# EAGLE design cnc_1_0_0 (EAGLE 6.2)

## Sheet 1 of 6
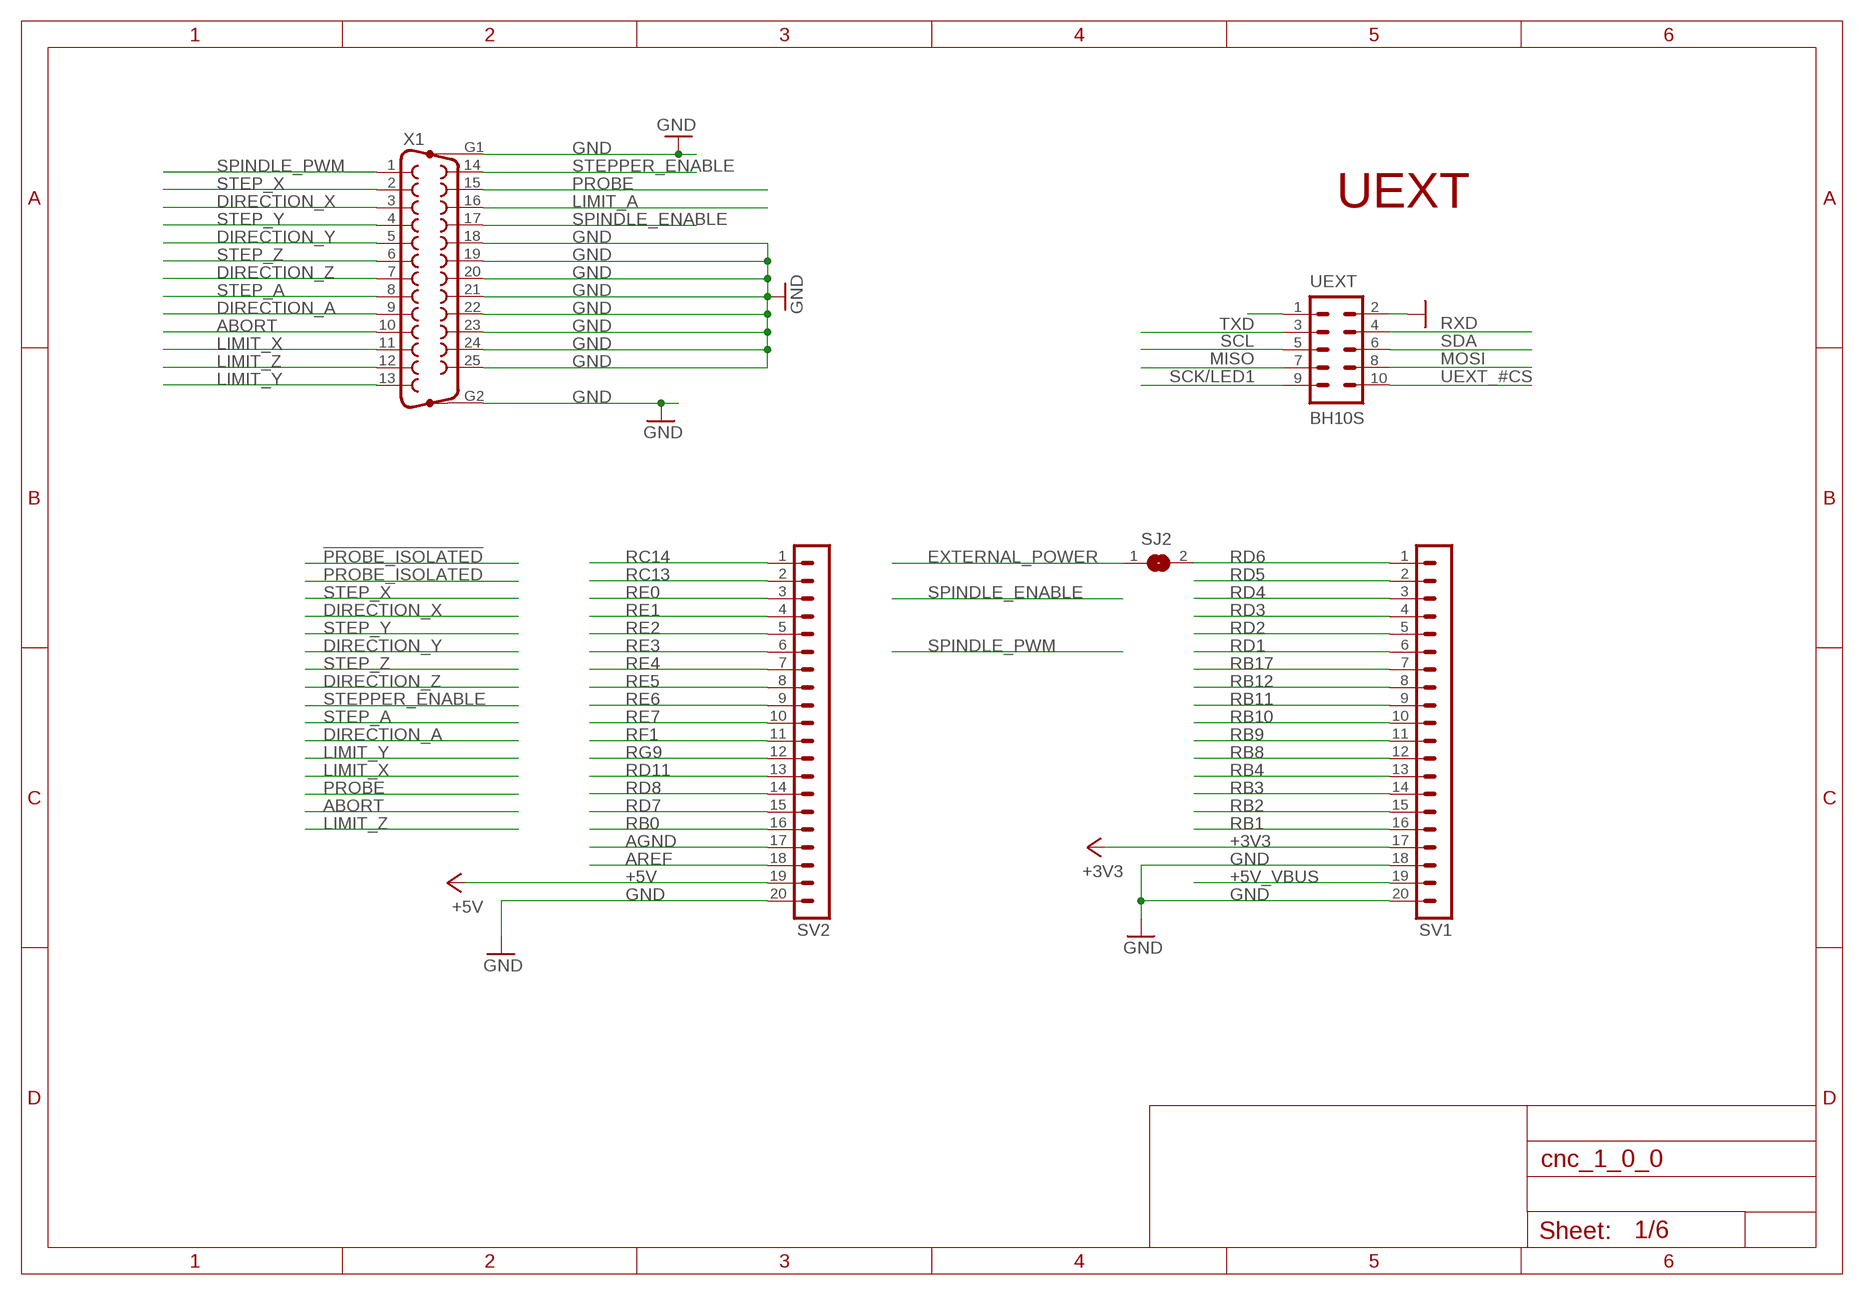
[diagram p0: schematic, sheet 1]

### Parts
SJ2  SJ  [SJ]
SV1  MA20-1  [MA20-1]
SV2  MA20-1  [MA20-1]
UEXT  BH10S  ML10  [ML10-MALE]
X1  F25HP  [F25HP]

### Nets
+3V3: SV1.17 ; also sheet 3,4,5
+5V [pwr]: SV2.19 ; also sheet 2,3,4
+5V_VBUS: SV1.19
ABORT: X1.10 ; also sheet 4
AGND: SV2.17
AREF: SV2.18
DIRECTION_A: X1.9 ; also sheet 3
DIRECTION_X: X1.3 ; also sheet 3
DIRECTION_Y: X1.5 ; also sheet 3
DIRECTION_Z: X1.7 ; also sheet 3
EXTERNAL_POWER: SJ2.1 ; also sheet 4
GND: SV1.18 SV1.20 SV2.20 UEXT.2 X1.18 X1.19 X1.20 X1.21 X1.22 X1.23 X1.24 X1.25 X1.G1 X1.G2 ; also sheet 2,3,4,5
LIMIT_A: X1.16
LIMIT_X: X1.11 ; also sheet 4
LIMIT_Y: X1.13 ; also sheet 4
LIMIT_Z: X1.12 ; also sheet 4
MISO: UEXT.7 ; also sheet 5
MOSI: UEXT.8 ; also sheet 5
N$9: UEXT.1
PROBE: X1.15 ; also sheet 4
RB0: SV2.16 ; also sheet 4
RB1: SV1.16
RB2: SV1.15
RB3: SV1.14
RB4: SV1.13
RB8: SV1.12
RB9: SV1.11
RB10: SV1.10
RB11: SV1.9
RB12: SV1.8
RB17: SV1.7
RC13: SV2.2 ; also sheet 4
RC14: SV2.1 ; also sheet 4
RD1: SV1.6 ; also sheet 3
RD2: SV1.5
RD3: SV1.4
RD4 [signal]: SV1.3 ; also sheet 3
RD5: SV1.2
RD6: SJ2.2 SV1.1
RD7: SV2.15 ; also sheet 4
RD8: SV2.14 ; also sheet 4
RD11: SV2.13 ; also sheet 4
RE0: SV2.3 ; also sheet 3
RE1: SV2.4 ; also sheet 3
RE2: SV2.5 ; also sheet 3
RE3: SV2.6 ; also sheet 3
RE4: SV2.7 ; also sheet 3
RE5: SV2.8 ; also sheet 3
RE6: SV2.9 ; also sheet 3
RE7: SV2.10 ; also sheet 3
RF1: SV2.11 ; also sheet 3
RG9: SV2.12 ; also sheet 4
RXD: UEXT.4
SCK/LED1: UEXT.9 ; also sheet 5
SCL: UEXT.5
SDA: UEXT.6
SPINDLE_ENABLE: X1.17 ; also sheet 3
SPINDLE_PWM: X1.1 ; also sheet 3
STEP_A: X1.8 ; also sheet 3
STEP_X: X1.2 ; also sheet 3
STEP_Y: X1.4 ; also sheet 3
STEP_Z: X1.6 ; also sheet 3
STEPPER_ENABLE: X1.14 ; also sheet 3
TXD: UEXT.3
UEXT_#CS: UEXT.10 ; also sheet 5

### Notes on the sheet
- UEXT

## Sheet 2 of 6
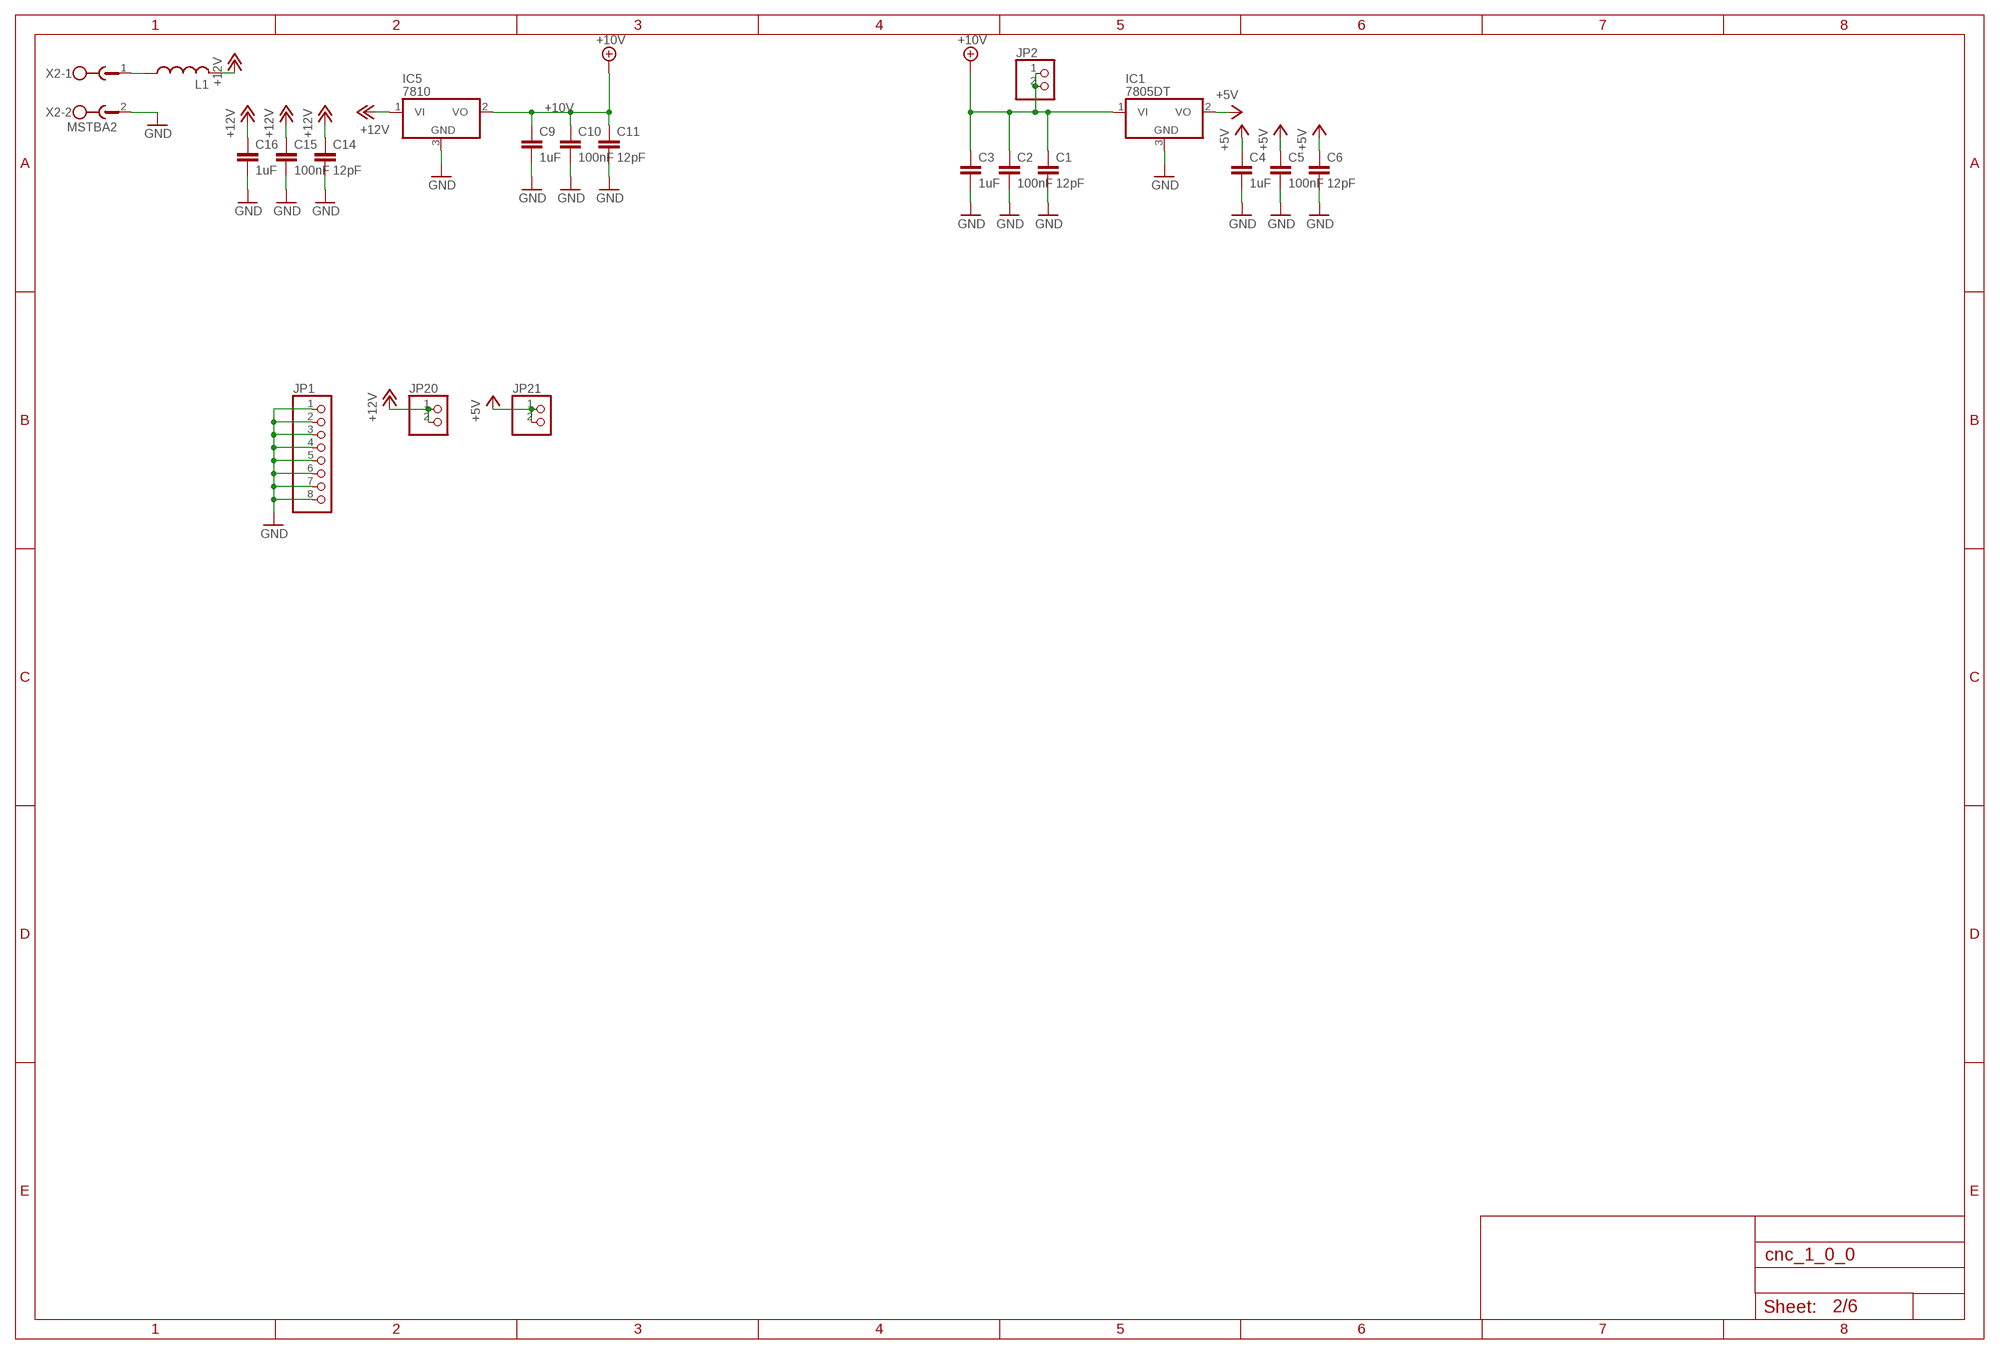
[diagram p1: schematic, sheet 2]

### Parts
C1  12pF  C-EUC0805K  [C0805K]
C2  100nF  C-EUC0805K  [C0805K]
C3  1uF  C-EUC0805K  [C0805K]
C4  1uF  C-EUC0805K  [C0805K]
C5  100nF  C-EUC0805K  [C0805K]
C6  12pF  C-EUC0805K  [C0805K]
C9  1uF  C-EUC0805K  [C0805K]
C10  100nF  C-EUC0805K  [C0805K]
C11  12pF  C-EUC0805K  [C0805K]
C14  12pF  C-EUC0805K  [C0805K]
C15  100nF  C-EUC0805K  [C0805K]
C16  1uF  C-EUC0805K  [C0805K]
IC1  7805DT  [TO252]
IC5  7810  7805DT  [TO252]
JP1  PINHD-1X8  [1X08]
JP2  PINHD-1X2  [1X02]
JP20  PINHD-1X2  [1X02]
JP21  PINHD-1X2  [1X02]
L1  L-USL1812  [L1812]
X2  MSTBA2  [MSTBA2]

### Nets
+5V [pwr]: C4.1 C5.1 C6.1 IC1.2(VO) JP21.1 JP21.2 ; also sheet 1,3,4
+10V [pwr]: C1.1 C2.1 C3.1 C9.1 C10.1 C11.1 IC1.1(VI) IC5.2(VO) JP2.1 JP2.2 ; also sheet 3
+12V [pwr]: C14.1 C15.1 C16.1 IC5.1(VI) JP20.1 JP20.2 L1.2 ; also sheet 4
GND: C1.2 C2.2 C3.2 C4.2 C5.2 C6.2 C9.2 C10.2 C11.2 C14.2 C15.2 C16.2 IC1.3(GND) IC5.3(GND) JP1.1 JP1.2 JP1.3 JP1.4 JP1.5 JP1.6 JP1.7 JP1.8 X2.2 ; also sheet 1,3,4,5
N$1: L1.1 X2.1

## Sheet 3 of 6
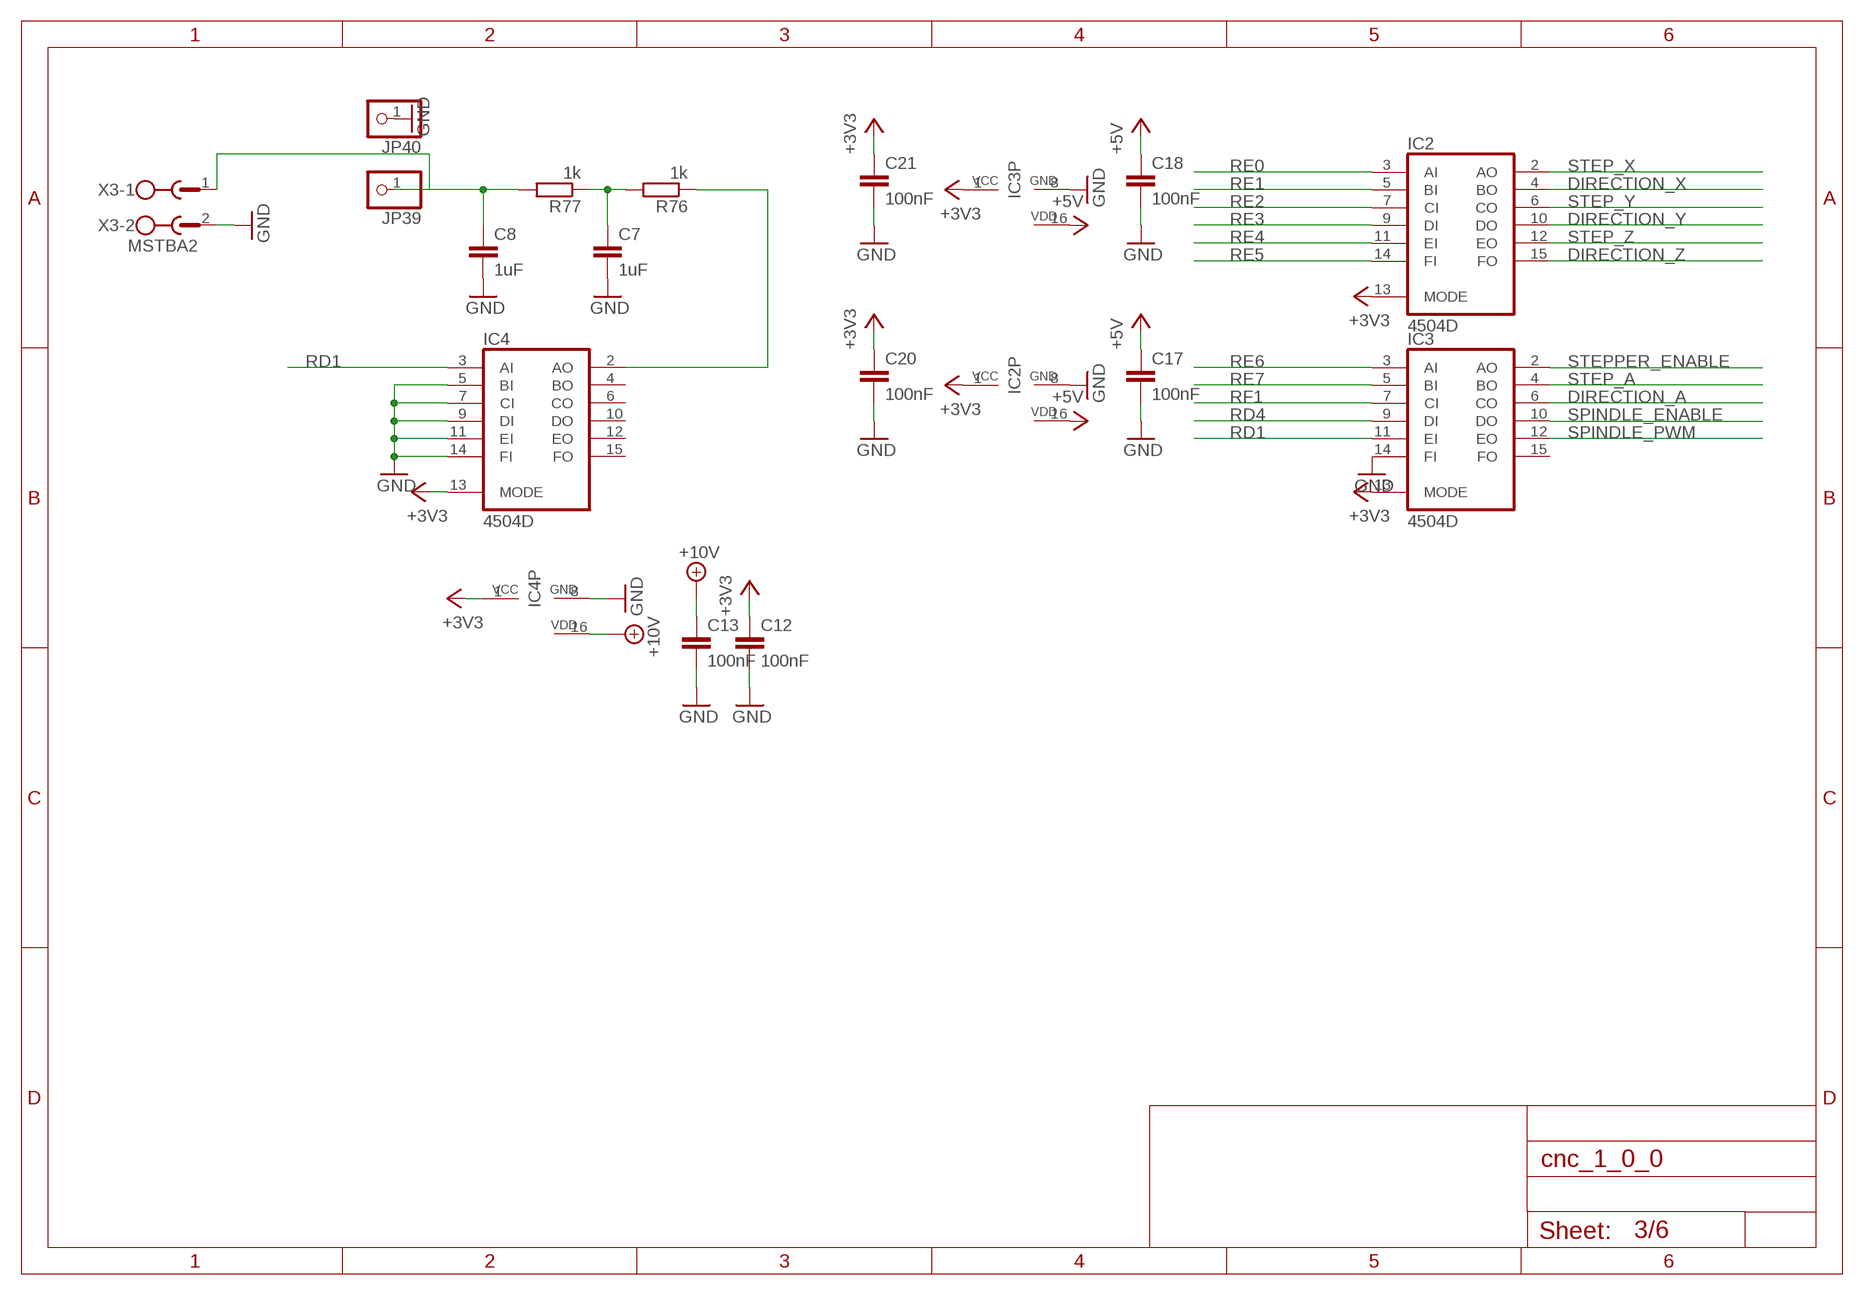
[diagram p2: schematic, sheet 3]

### Parts
C7  1uF  C-EUC0805K  [C0805K]
C8  1uF  C-EUC0805K  [C0805K]
C12  100nF  C-EUC0805K  [C0805K]
C13  100nF  C-EUC0805K  [C0805K]
C17  100nF  C-EUC0805K  [C0805K]
C18  100nF  C-EUC0805K  [C0805K]
C20  100nF  C-EUC0805K  [C0805K]
C21  100nF  C-EUC0805K  [C0805K]
IC2  4504D  [SO16]
IC3  4504D  [SO16]
IC4  4504D  [SO16]
JP39  PINHD-1X1  [1X01]
JP40  PINHD-1X1  [1X01]
R76  1k  R-EU_R0805  [R0805]
R77  1k  R-EU_R0805  [R0805]
X3  MSTBA2  [MSTBA2]

### Nets
+3V3: C12.1 C20.1 C21.1 IC2.1(VCC) IC2.13(MODE) IC3.1(VCC) IC3.13(MODE) IC4.1(VCC) IC4.13(MODE) ; also sheet 1,4,5
+5V [pwr]: C17.1 C18.1 IC2.16(VDD) IC3.16(VDD) ; also sheet 1,2,4
+10V [pwr]: C13.1 IC4.16(VDD) ; also sheet 2
DIRECTION_A: IC3.6(CO) ; also sheet 1
DIRECTION_X: IC2.4(BO) ; also sheet 1
DIRECTION_Y: IC2.10(DO) ; also sheet 1
DIRECTION_Z: IC2.15(FO) ; also sheet 1
GND: C7.2 C8.2 C12.2 C13.2 C17.2 C18.2 C20.2 C21.2 IC2.8(GND) IC3.8(GND) IC3.14(FI) IC4.5(BI) IC4.7(CI) IC4.8(GND) IC4.9(DI) IC4.11(EI) IC4.14(FI) JP40.1 X3.2 ; also sheet 1,2,4,5
N$3: C7.1 R76.2 R77.1
N$45: C8.1 JP39.1 R77.2 X3.1
N$47: IC4.2(AO) R76.1
RD1: IC3.11(EI) IC4.3(AI) ; also sheet 1
RD4 [signal]: IC3.9(DI) ; also sheet 1
RE0: IC2.3(AI) ; also sheet 1
RE1: IC2.5(BI) ; also sheet 1
RE2: IC2.7(CI) ; also sheet 1
RE3: IC2.9(DI) ; also sheet 1
RE4: IC2.11(EI) ; also sheet 1
RE5: IC2.14(FI) ; also sheet 1
RE6: IC3.3(AI) ; also sheet 1
RE7: IC3.5(BI) ; also sheet 1
RF1: IC3.7(CI) ; also sheet 1
SPINDLE_ENABLE: IC3.10(DO) ; also sheet 1
SPINDLE_PWM: IC3.12(EO) ; also sheet 1
STEP_A: IC3.4(BO) ; also sheet 1
STEP_X: IC2.2(AO) ; also sheet 1
STEP_Y: IC2.6(CO) ; also sheet 1
STEP_Z: IC2.12(EO) ; also sheet 1
STEPPER_ENABLE: IC3.2(AO) ; also sheet 1
Unconnected: IC3.15(FO) IC4.4(BO) IC4.6(CO) IC4.10(DO) IC4.12(EO) IC4.15(FO)

## Sheet 4 of 6
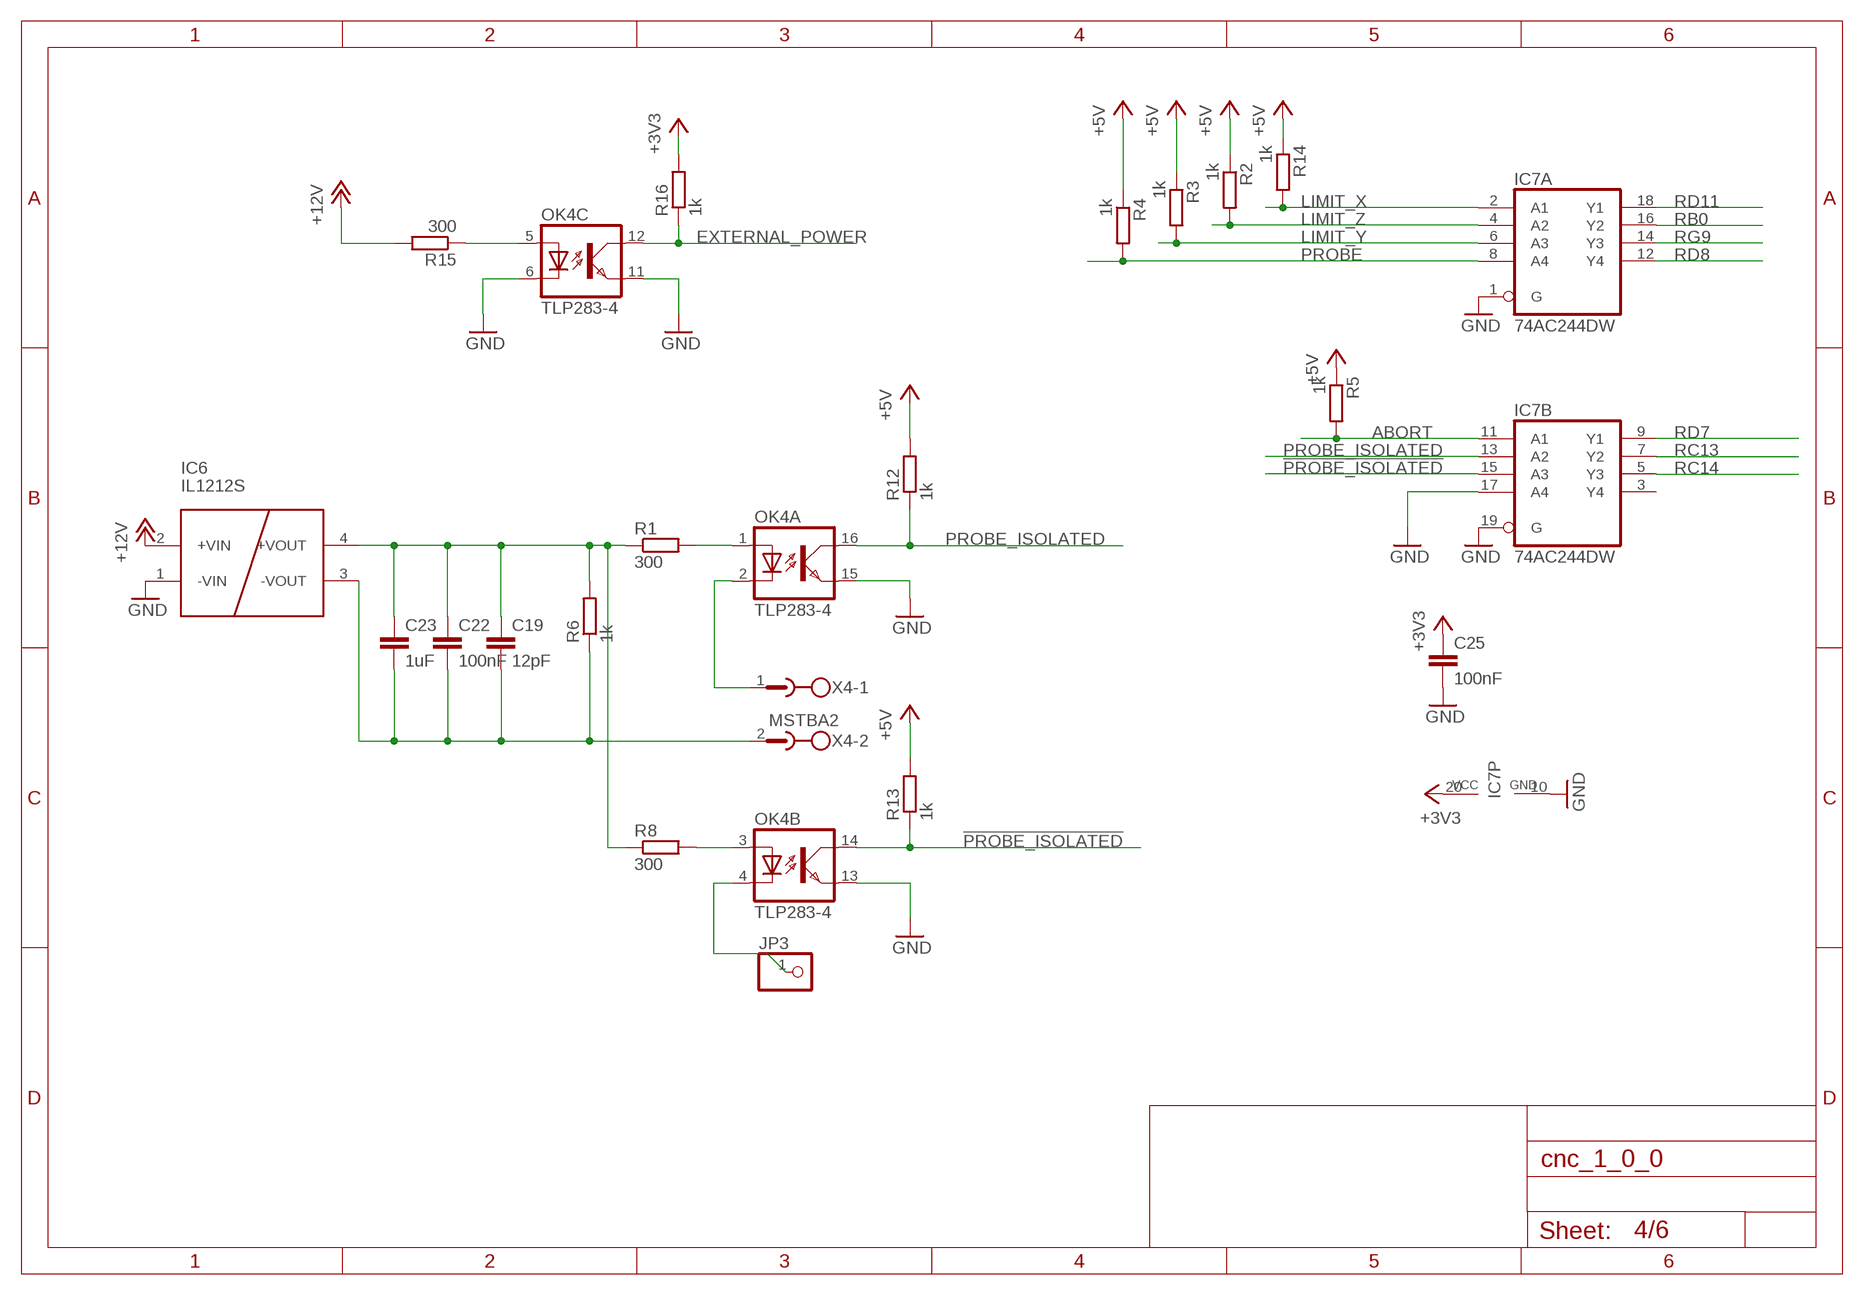
[diagram p3: schematic, sheet 4]

### Parts
C19  12pF  C-EUC0805K  [C0805K]
C22  100nF  C-EUC0805K  [C0805K]
C23  1uF  C-EUC0805K  [C0805K]
C25  100nF  C-EUC0805K  [C0805K]
IC6  IL1212S  IL0512S  [SIL4]
IC7  74AC244DW  [SO20W]
JP3  PINHD-1X1  [1X01]
OK4  TLP283-4  [MINI-FLAT-16]
R1  300  R-EU_R0805  [R0805]
R2  1k  R-EU_R0805  [R0805]
R3  1k  R-EU_R0805  [R0805]
R4  1k  R-EU_R0805  [R0805]
R5  1k  R-EU_R0805  [R0805]
R6  1k  R-EU_R0805  [R0805]
R8  300  R-EU_R0805  [R0805]
R12  1k  R-EU_R0805  [R0805]
R13  1k  R-EU_R0805  [R0805]
R14  1k  R-EU_R0805  [R0805]
R15  300  R-EU_R0805  [R0805]
R16  1k  R-EU_R0805  [R0805]
X4  MSTBA2  [MSTBA2]

### Nets
!PROBE_ISOLATED: IC7.15(B:A3) OK4.14(B:COL) R13.1 ; also sheet 1
+3V3: C25.1 IC7.20(P:VCC) R16.2 ; also sheet 1,3,5
+5V [pwr]: R2.1 R3.1 R4.1 R5.1 R12.2 R13.2 R14.1 ; also sheet 1,2,3
+10V1: C19.1 C22.1 C23.1 IC6.4(+VOUT) R1.1 R6.2 R8.1
+12V [pwr]: IC6.2(+VIN) R15.2 ; also sheet 2
ABORT: IC7.11(B:A1) R5.2 ; also sheet 1
EXTERNAL_POWER: OK4.12(C:COL) R16.1 ; also sheet 1
GND: C25.2 IC6.1(-VIN) IC7.1(A:G) IC7.10(P:GND) IC7.17(B:A4) IC7.19(B:G) OK4.6(C:C) OK4.11(C:EMIT) OK4.13(B:EMIT) OK4.15(A:EMIT) ; also sheet 1,2,3,5
LIMIT_X: IC7.2(A:A1) R14.2 ; also sheet 1
LIMIT_Y: IC7.6(A:A3) R3.2 ; also sheet 1
LIMIT_Z: IC7.4(A:A2) R2.2 ; also sheet 1
N$5: OK4.1(A:A) R1.2
N$6: OK4.2(A:C) X4.1
N$7: C19.2 C22.2 C23.2 IC6.3(-VOUT) R6.1 X4.2
N$11: OK4.3(B:A) R8.2
N$12: JP3.1 OK4.4(B:C)
N$13: OK4.5(C:A) R15.1
PROBE: IC7.8(A:A4) R4.2 ; also sheet 1
PROBE_ISOLATED: IC7.13(B:A2) OK4.16(A:COL) R12.1 ; also sheet 1
RB0: IC7.16(A:Y2) ; also sheet 1
RC13: IC7.7(B:Y2) ; also sheet 1
RC14: IC7.5(B:Y3) ; also sheet 1
RD7: IC7.9(B:Y1) ; also sheet 1
RD8: IC7.12(A:Y4) ; also sheet 1
RD11: IC7.18(A:Y1) ; also sheet 1
RG9: IC7.14(A:Y3) ; also sheet 1
Unconnected: IC7.3(B:Y4) OK4.7(D:A) OK4.8(D:C) OK4.9(D:EMIT) OK4.10(D:COL)

## Sheet 5 of 6
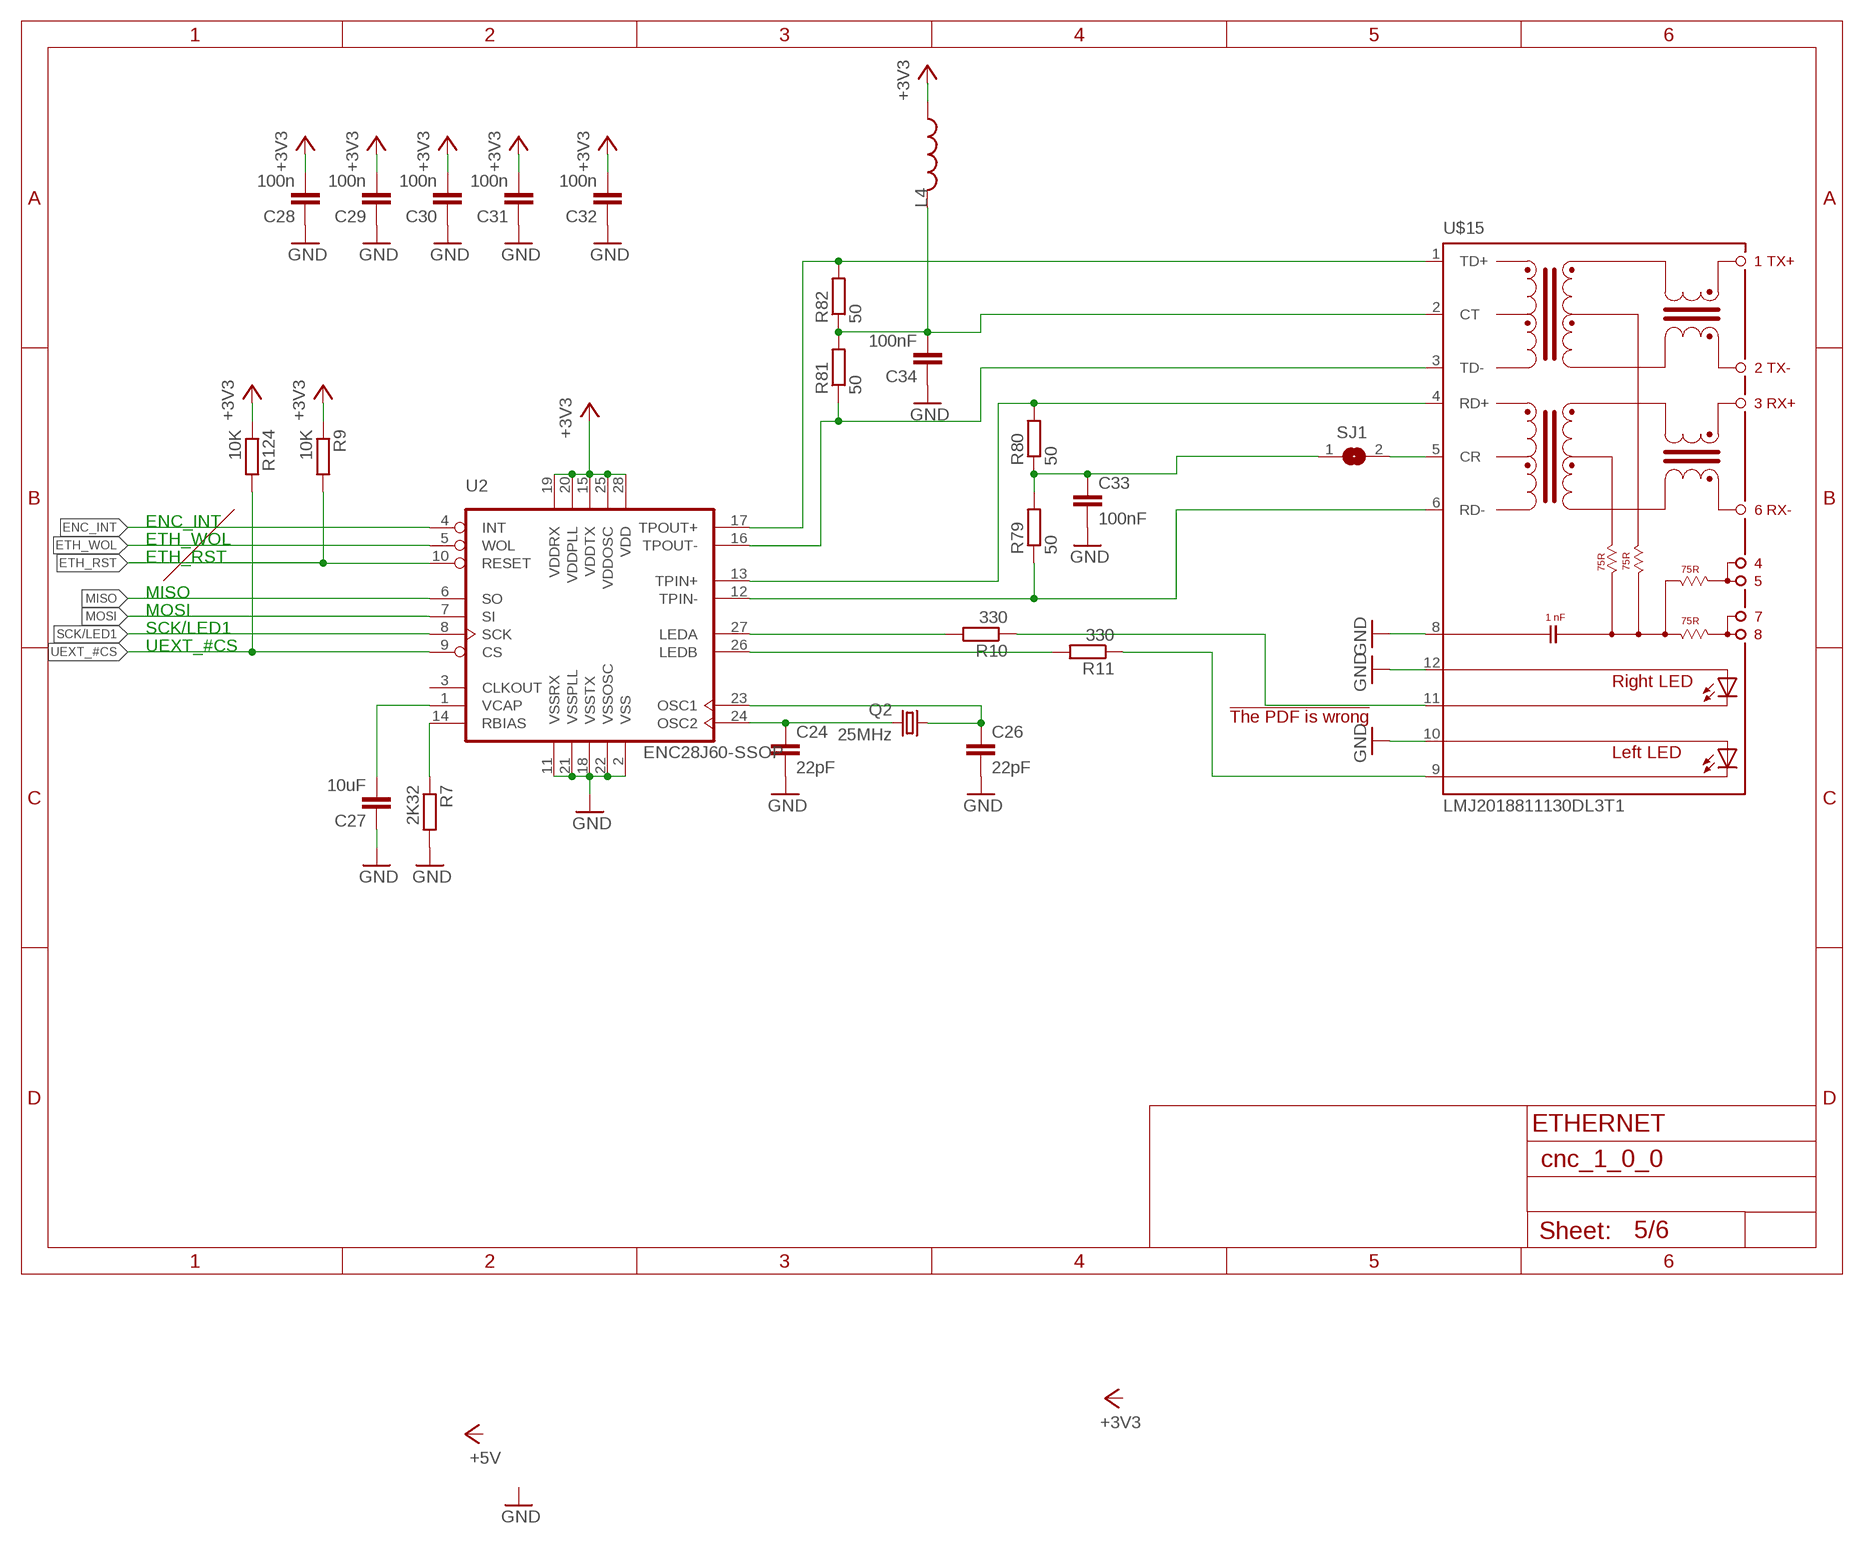
[diagram p4: schematic, sheet 5]

### Parts
C24  22pF  C-EUC0603  [C0603]
C26  22pF  C-EUC0603  [C0603]
C27  10uF  C-EUC0805K  [C0805K]
C28  100n  C-EUC0603  [C0603]
C29  100n  C-EUC0603  [C0603]
C30  100n  C-EUC0603  [C0603]
C31  100n  C-EUC0603  [C0603]
C32  100n  C-EUC0603  [C0603]
C33  100nF  C-EUC0603  [C0603]
C34  100nF  C-EUC0603  [C0603]
L4  INDUCTOR0603  [0603]
Q2  25MHz  CRYSTAL5X3  [CRYSTAL-SMD-5X3]
R7  2K32  R-EU_R0805  [R0805]
R9  10K  R-EU_R0805  [R0805]
R10  330  R-EU_R0805  [R0805]
R11  330  R-EU_R0805  [R0805]
R79  50  R-EU_R0603  [R0603]
R80  50  R-EU_R0603  [R0603]
R81  50  R-EU_R0603  [R0603]
R82  50  R-EU_R0603  [R0603]
R124  10K  R-EU_R0805  [R0805]
SJ1  SJ  [SJ]
U2  ENC28J60-SSOP  [SSOP28]
U$15  LMJ2018811130DL3T1  AMPHENOL-LMJ2018814100DL2T1B_LMJ2018814100DL  [AMPHENOL-LMJ2018814100DL2T1B_RJ45]

### Nets
+3V3: C28.2 C29.2 C30.2 C31.2 C32.2 L4.1 R9.1 R124.1 U2.15(VDDTX) U2.19(VDDRX) U2.20(VDDPLL) U2.25(VDDOSC) U2.28(VDD) ; also sheet 1,3,4
CT1: C34.2 L4.2 R81.2 R82.1 U$15.2(CT)
ENC_INT: U2.4(INT)
ETH_RST: R9.2 U2.10(RESET)
ETH_WOL: U2.5(WOL)
GND: C24.2 C26.2 C27.1 C28.1 C29.1 C30.1 C31.1 C32.1 C33.2 C34.1 R7.2 U2.2(VSS) U2.11(VSSRX) U2.18(VSSTX) U2.21(VSSPLL) U2.22(VSSOSC) U$15.8 U$15.10(A-L) U$15.12(A-R) ; also sheet 1,2,3,4
MISO: U2.6(SO) ; also sheet 1
MOSI: U2.7(SI) ; also sheet 1
N$2: C24.1 Q2.3 U2.24(OSC2)
N$4: R11.2 U2.26(LEDB)
N$8: SJ1.2 U$15.5(CR)
N$10: R10.2 U2.27(LEDA)
N$53: C26.1 Q2.1 U2.23(OSC1)
N$54: R7.1 U2.14(RBIAS)
N$55: C27.2 U2.1(VCAP)
N$57: C33.1 R79.2 R80.1 SJ1.1
N$74: R10.1 U$15.11(C-R)
N$76: R11.1 U$15.9(C-L)
SCK/LED1: U2.8(SCK) ; also sheet 1
TPIN+: R80.2 U2.13(TPIN+) U$15.4(RD+)
TPIN-: R79.1 U2.12(TPIN-) U$15.6(RD-)
TPOUT+: R82.2 U2.17(TPOUT+) U$15.1(TD+)
TPOUT-: R81.1 U2.16(TPOUT-) U$15.3(TD-)
UEXT_#CS: R124.2 U2.9(CS) ; also sheet 1
Unconnected: U2.3(CLKOUT)

### Notes on the sheet
- !The PDF is wrong!
- ETHERNET

## Sheet 6 of 6
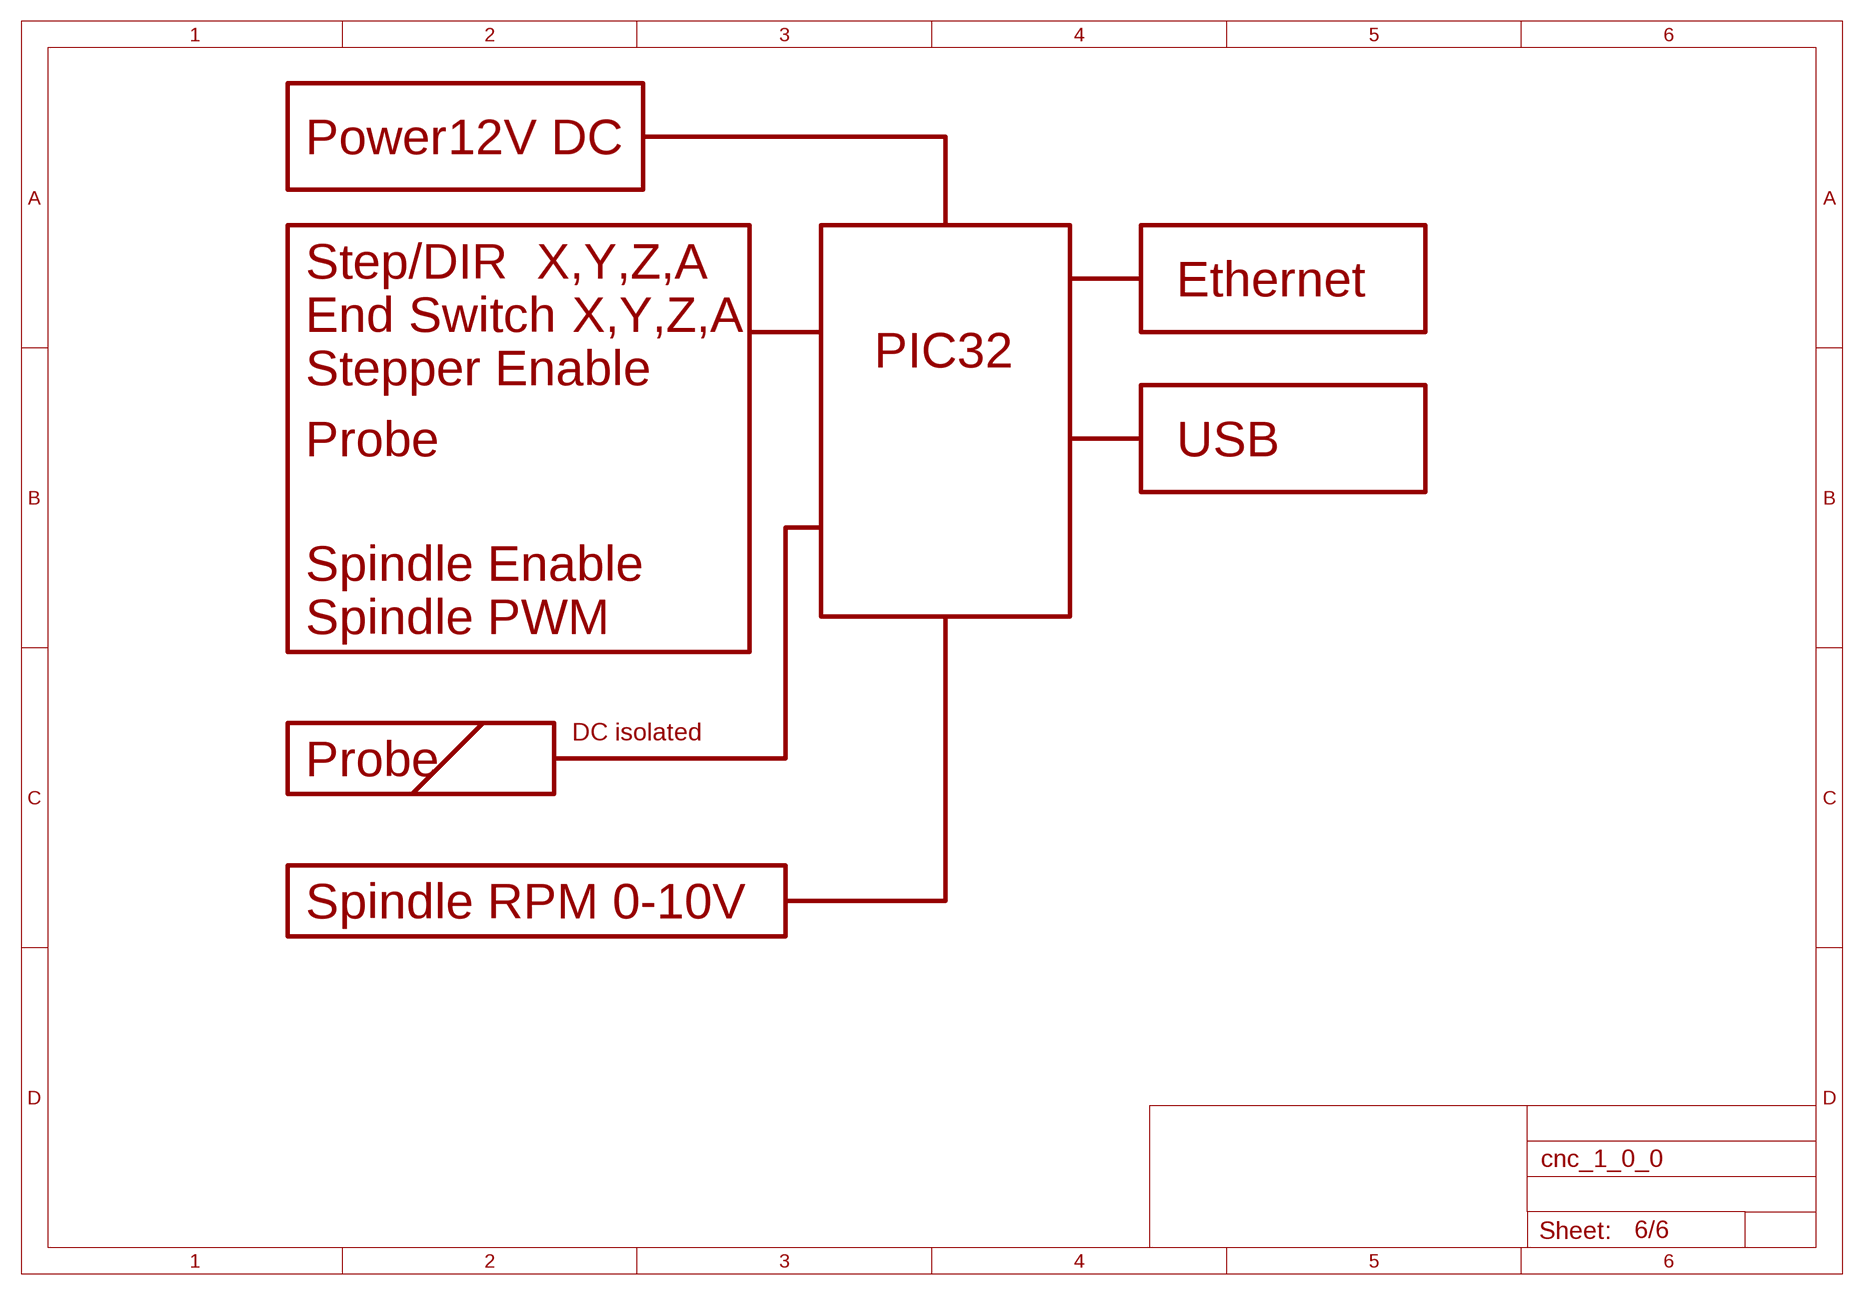
[diagram p5: schematic, sheet 6]

### Notes on the sheet
- Power | 12V DC
- Step/DIR | X,Y,Z,A
- Ethernet
- End Switch | X,Y,Z,A
- PIC32
- Stepper Enable
- Probe | USB
- Spindle Enable
- Spindle PWM
- DC isolated
- Probe
- Spindle RPM 0-10V

## Library data of the parts
C1-C34 = rcl:C-EU: CAPACITOR, European symbol
IC1 IC5 = linear:78*: Positive VOLTAGE REGULATOR Source: http://cache.national.com/ds/LM/LM78L05.pdf http://www.fairchildsemi.com/ds/LM/LM7805.pdf
IC2-IC4 = 45xx:4504: TTL or CMOS to CMOS hex LEVEL SHIFTER
IC6 = IsolatedDCDC:IL0512S
IC7 = 74xx-eu:74*244: Octal BUFFER and LINE DRIVER, 3-state
JP1 = pinhead:PINHD-1X8: PIN HEADER
JP2 JP20 JP21 = pinhead:PINHD-1X2: PIN HEADER
JP3 JP39 JP40 = pinhead:PINHD-1X1: PIN HEADER
L1 = rcl:L-US: INDUCTOR, American symbol
L4 = SparkFun:INDUCTOR: Inductors Basic Inductor/Choke - 0603 and 1206. Footprints are not proven and vary greatly between part numbers.
OK4 = optocoupler:TLP283-4: TOSHIBA PHOTOCOUPLER GaAs IRED & PHOTO-TRANSISTOR Source: http://www.semicon.toshiba.co.jp/td/en/Opto/Photocoupler/en_20050928_TLP283_datasheet.pdf; OC_FARNELL: unknown; OC_NEWARK: unknown
Q2 = SparkFun:CRYSTAL: Crystals Various standard crystals. Proven footprints. Spark Fun Electronics SKU : COM-00534
R1-R16 R76 R77 R79-R82 R124 = rcl:R-EU_: RESISTOR, European symbol
SJ1 SJ2 = jumper:SJ: SMD solder JUMPER
SV1 SV2 = con-lstb:MA20-1: PIN HEADER; OC_FARNELL: unknown; OC_NEWARK: unknown
U2 = microchip-enc28j60:ENC28J60-*: Microchip 10Mbit Eth. contoller with SPI interface
U$15 = Controller2:AMPHENOL-LMJ2018814100DL2T1B_LMJ2018814100DL
UEXT = con-harting-ml:ML10: HARTING
X1 = con-subd:F25HP: SUB-D; OC_FARNELL: unknown; OC_MOUSER: https://www.mouser.de/ProductDetail/636-182-025-113R531; OC_NEWARK: unknown
X2-X4 = con-phoenix-508:MSTBA2: PHOENIX; MF: FARNELL; MPN: 1757242; OC_FARNELL: 3705171; OC_NEWARK: 71C4161

## Net classes
1 pwr: width 0.25 mm
2 signal: width 0.406 mm, clearance 0.406 mm to class 0, clearance 0.406 mm to class 1, clearance 0.406 mm

## Board
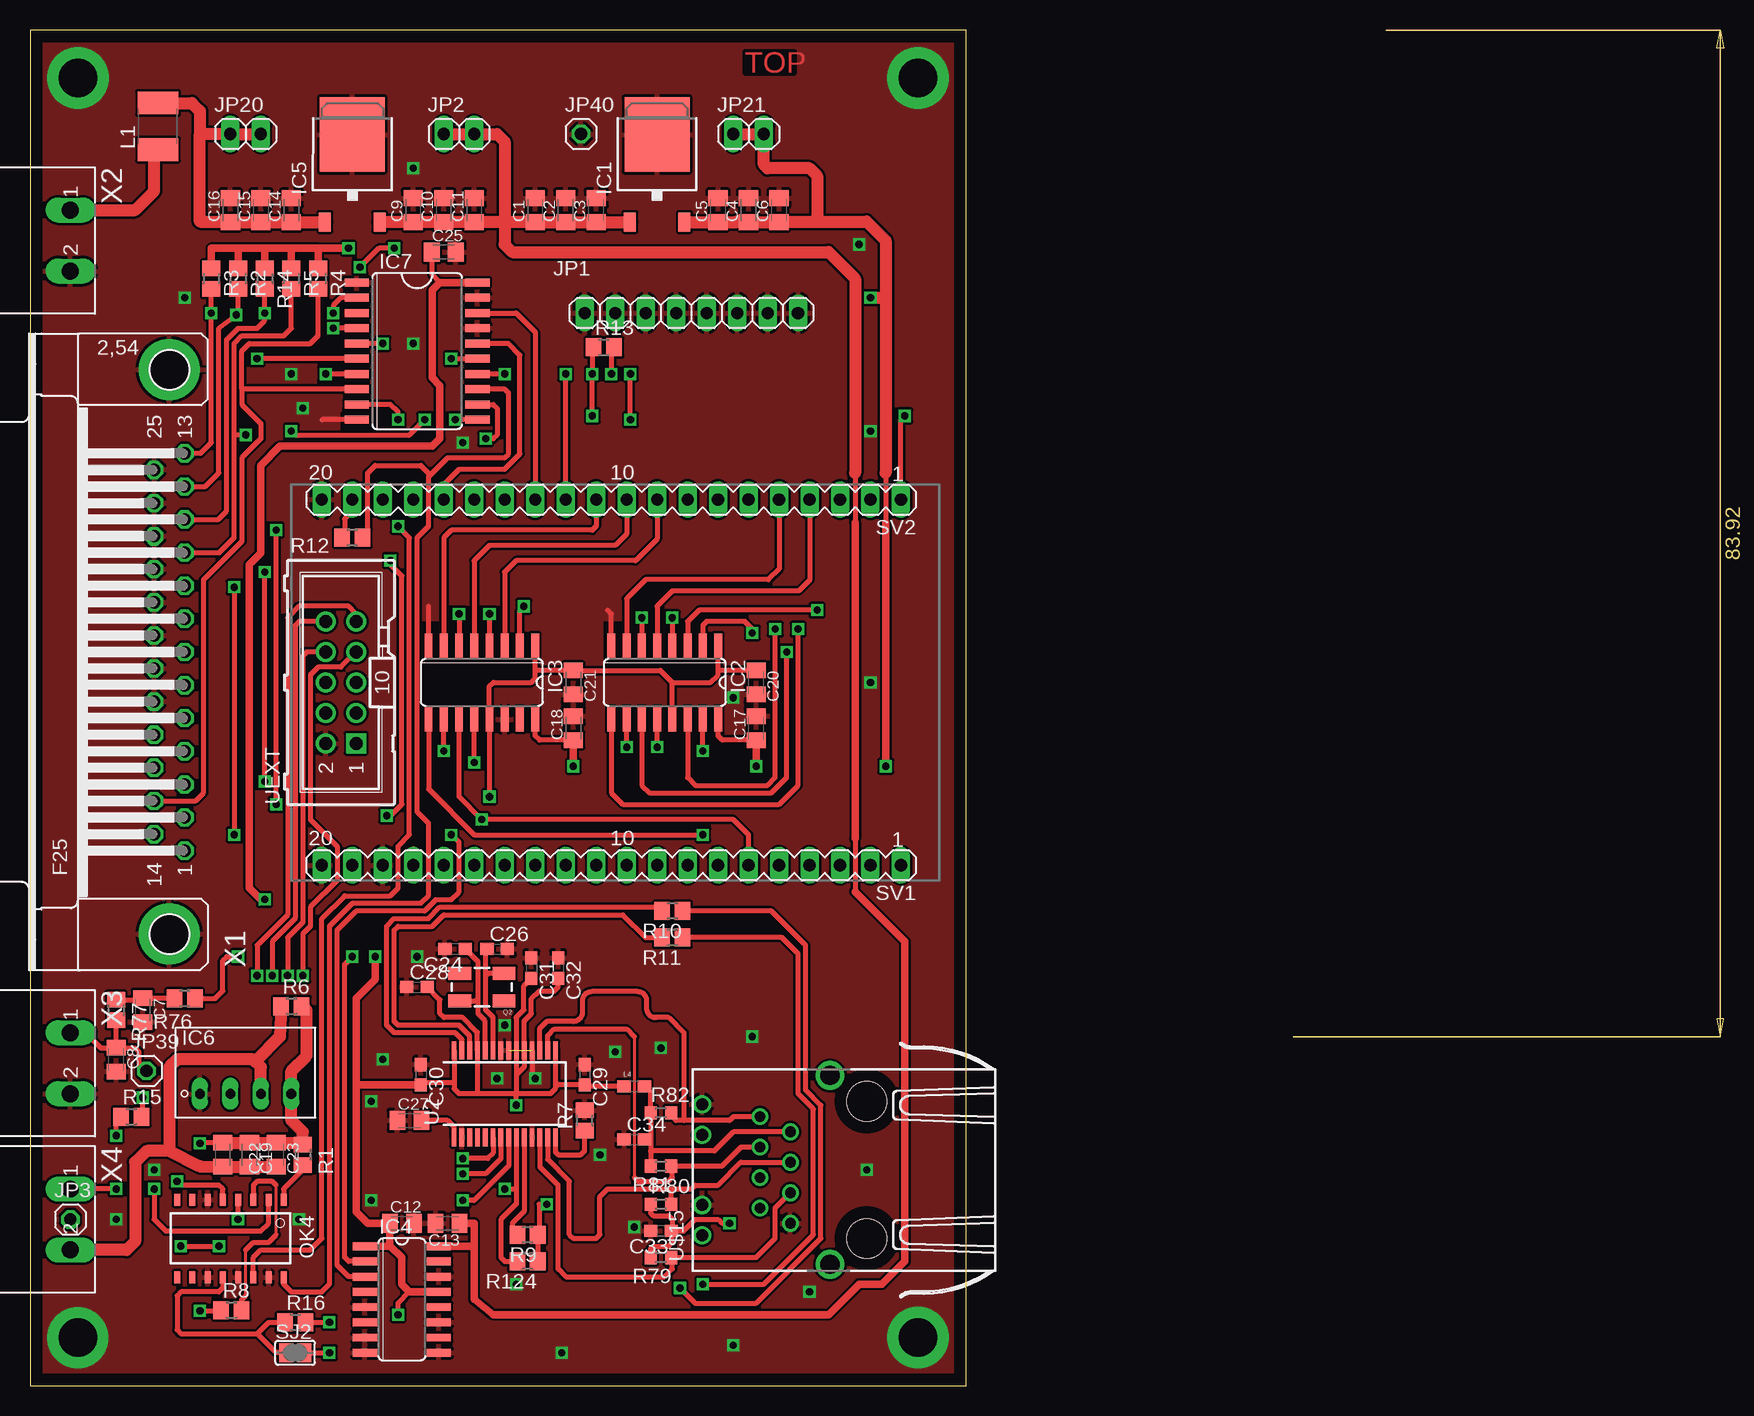
[diagram p6: board, top side]
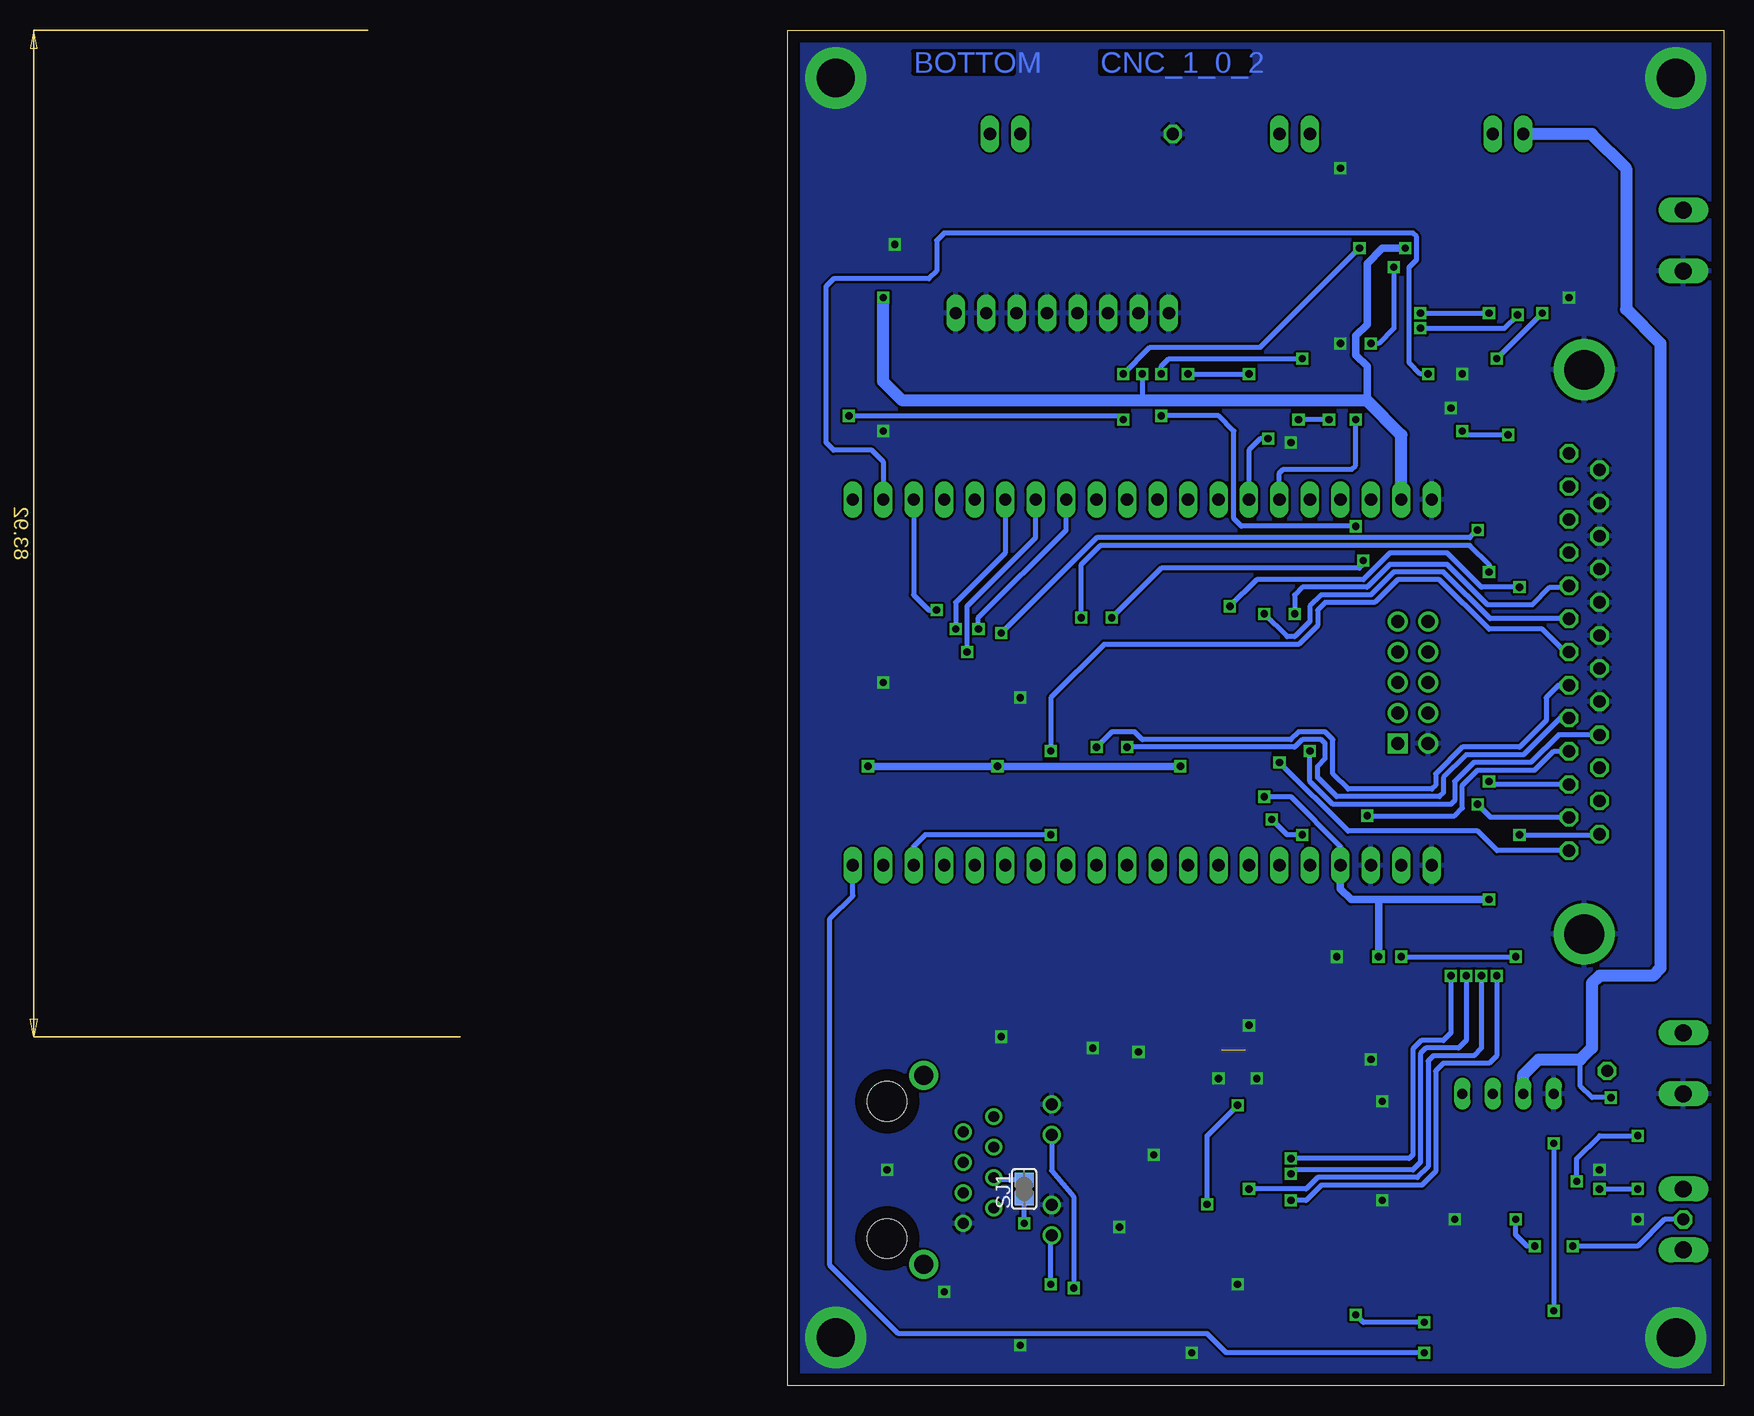
[diagram p7: board, bottom side, seen from below]

Size 78 x 113 mm. Coordinates in mm from the lower left corner, seen from the top.
Outline: 0,0 78,0 78,113 0,113 0,0
Copper layers (1*16): Top 0.035mm / dielectric 1.5mm / Bottom 0.035mm
Design rules: minimum track width 16mil, minimum drill 0.6mm, track to track 8mil, track to pad 8mil, pad to pad 8mil, via to via 8mil, smd to smd 8mil, copper to edge 40mil, drill to drill 8mil, minimum pad ring 10mil, minimum via ring 8mil, stop-mask expansion 4mil, vias tented up to drill 0mil, thermal gap 10mil
tRestrict: area 32.6,59.9 to 33.8,63.7; area 47.8,59.9 to 49.1,63.7; area 25.9,79.9 to 29.7,81.2

### Footprints (pad centres in the part's own frame; a part is rotated, then mirrored left to right if it is on the bottom)
C0805K = smd 1.3 x 1.6: 1 -1,0; 2 1,0
C0603 = smd 1.1 x 1: 1 -0.85,0; 2 0.85,0
TO252 = smd 1 x 1.6: 1 -2.28,-4.8; 2 2.28,-4.8 | smd 5.4 x 6.2: 3 0,2.5
SO16 = smd 0.66 x 2.032: 1 -4.445,-3.073; 2 -3.175,-3.073; 3 -1.905,-3.073; 4 -0.635,-3.073; 5 0.635,-3.073; 6 1.905,-3.073; 7 3.175,-3.073; 8 4.445,-3.073; 9 4.445,3.073; 10 3.175,3.073; 11 1.905,3.073; 12 0.635,3.073; 13 -0.635,3.073; 14 -1.905,3.073; 15 -3.175,3.073; 16 -4.445,3.073
SIL4 = drill 0.813 long: 1 0,0; 2 2.54,0; 3 5.08,0; 4 7.62,0
SO20W = smd 0.66 x 2.032: 1 -5.715,-5.029; 2 -4.445,-5.029; 3 -3.175,-5.029; 4 -1.905,-5.029; 5 -0.635,-5.029; 6 0.635,-5.029; 7 1.905,-5.029; 8 3.175,-5.029; 9 4.445,-5.029; 10 5.715,-5.029; 11 5.715,5.029; 12 4.445,5.029; 13 3.175,5.029; 14 1.905,5.029; 15 0.635,5.029; 16 -0.635,5.029; 17 -1.905,5.029; 18 -3.175,5.029; 19 -4.445,5.029; 20 -5.715,5.029
1X08 = drill 1.016 long: 1 -8.89,0; 2 -6.35,0; 3 -3.81,0; 4 -1.27,0; 5 1.27,0; 6 3.81,0; 7 6.35,0; 8 8.89,0
1X02 = drill 1.016 long: 1 -1.27,0; 2 1.27,0
1X01 = drill 1.016 octagon: 1 0,0
L1812 = smd 1.9 x 3.4: 1 -1.95,0; 2 1.95,0
0603 = smd 1.1 x 1: 1 -0.85,0; 2 0.85,0
MINI-FLAT-16 = smd 1 x 0.5: 1 -3.24,4.445; 2 -3.24,3.175; 3 -3.24,1.905; 4 -3.24,0.635; 5 -3.24,-0.635; 6 -3.24,-1.905; 7 -3.24,-3.175; 8 -3.24,-4.445; 9 3.24,-4.445; 10 3.24,-3.175; 11 3.24,-1.905; 12 3.24,-0.635; 13 3.24,0.635; 14 3.24,1.905; 15 3.24,3.175; 16 3.24,4.445
CRYSTAL-SMD-5X3 = smd 1.9 x 1.1: 1 -1.85,-1.15; 2 1.85,-1.15; 3 1.85,1.15; 4 -1.85,1.15
R0805 = smd 1.3 x 1.5: 1 -0.85,0; 2 0.85,0
R0603 = smd 1 x 1.1: 1 -0.85,0; 2 0.85,0
SJ = smd 1.168 x 1.6: 1 -0.762,0; 2 0.762,0
MA20-1 = drill 1.016 long: 1 -24.13,0; 2 -21.59,0; 3 -19.05,0; 4 -16.51,0; 5 -13.97,0; 6 -11.43,0; 7 -8.89,0; 8 -6.35,0; 9 -3.81,0; 10 -1.27,0; 11 1.27,0; 12 3.81,0; 13 6.35,0; 14 8.89,0; 15 11.43,0; 16 13.97,0; 17 16.51,0; 18 19.05,0; 19 21.59,0; 20 24.13,0
SSOP28 = smd 0.4 x 1.5: 1 -4.225,-3.625; 2 -3.575,-3.625; 3 -2.925,-3.625; 4 -2.275,-3.625; 5 -1.625,-3.625; 6 -0.975,-3.625; 7 -0.325,-3.625; 8 0.325,-3.625; 9 0.975,-3.625; 10 1.625,-3.625; 11 2.275,-3.625; 12 2.925,-3.625; 13 3.575,-3.625; 14 4.225,-3.625; 15 4.225,3.625; 16 3.575,3.625; 17 2.925,3.625; 18 2.275,3.625; 19 1.625,3.625; 20 0.975,3.625; 21 0.325,3.625; 22 -0.325,3.625; 23 -0.975,3.625; 24 -1.625,3.625; 25 -2.275,3.625; 26 -2.925,3.625; 27 -3.575,3.625; 28 -4.225,3.625
AMPHENOL-LMJ2018814100DL2T1B_RJ45 = drill 0.9 pad 1.3: 1 4.445,5.08; 2 3.175,2.54; 3 1.905,5.08; 4 0.635,2.54; 5 -0.635,5.08; 6 -1.905,2.54; 7 -3.175,5.08; 8 -4.445,2.54 | drill 1 pad 1.422: 9 -5.465,9.91; 10 -2.925,9.91; 11 2.925,9.91; 12 5.465,9.91 | drill 1.6 pad 2.184: M1 -7.875,-0.76; M2 7.875,-0.76 | hole 3.3: 5.715,-3.81; -5.715,-3.81
ML10-MALE = drill 1.1 pad 1.676 square: 1 -5.08,-1.27 | drill 1.1 pad 1.676: 2 -5.08,1.27; 3 -2.54,-1.27; 4 -2.54,1.27; 5 0,-1.27; 6 0,1.27; 7 2.54,-1.27; 8 2.54,1.27; 9 5.08,-1.27; 10 5.08,1.27
F25HP = drill 1.016 octagon: 1 -16.561,-1.27; 2 -13.792,-1.27; 3 -11.049,-1.27; 4 -8.28,-1.27; 5 -5.512,-1.27; 6 -2.769,-1.27; 7 0,-1.27; 8 2.769,-1.27; 9 5.512,-1.27; 10 8.28,-1.27; 11 11.049,-1.27; 12 13.792,-1.27; 13 16.561,-1.27; 14 -15.189,1.27; 15 -12.421,1.27; 16 -9.652,1.27; 17 -6.909,1.27; 18 -4.14,1.27; 19 -1.372,1.27; 20 1.372,1.27; 21 4.14,1.27; 22 6.909,1.27; 23 9.652,1.27; 24 12.421,1.27; 25 15.189,1.27 | drill 3.302 pad 5.08: G1 -23.52,0; G2 23.52,0
MSTBA2 = drill 1.397 long: 1 -2.54,5.08; 2 2.54,5.08

### Placement (x,y rotation side)
C1  42.1,97.98 90 top
C2  44.64,97.98 90 top
C3  47.18,97.98 90 top
C4  59.88,97.98 90 top
C5  57.34,97.98 90 top
C6  62.42,97.98 90 top
C7  9.4,31.3 270 top
C8  7.17,27.18 270 top
C9  31.94,97.98 90 top
C10  34.48,97.98 90 top
C11  37.02,97.98 90 top
C12  30.99,13.53 0 top
C13  34.8,13.53 180 top
C14  21.78,97.98 90 top
C15  19.24,97.98 90 top
C16  16.7,97.98 90 top
C17  60.52,54.8 90 top
C18  45.27,54.8 90 top
C19  18.29,19.24 270 top
C20  60.52,58.61 270 top
C21  45.27,58.61 270 top
C22  16.06,19.24 270 top
C23  20.51,19.24 270 top
C24  35.43,36.38 180 top
C25  34.48,94.49 0 top
C26  38.92,36.38 0 top
C27  31.62,22.1 0 top
C28  32.26,33.21 0 top
C29  46.23,25.91 270 top
C30  32.58,25.91 270 top
C31  41.78,34.8 270 top
C32  44.01,34.8 270 top
C33  52.58,12.89 180 top
C34  50.35,20.51 0 top
IC1  52.26,101.79 0 top
IC2  52.9,58.61 180 top
IC3  37.66,58.61 180 top
IC4  30.99,7.17 270 top
IC5  26.86,101.79 0 top
IC6  14.16,24.32 0 top
IC7  32.26,86.23 270 top
JP1  55.12,89.41 0 top
JP2  35.75,104.33 0 top
JP3  3.37,13.84 0 top
JP20  17.97,104.33 0 top
JP21  59.88,104.33 0 top
JP39  9.71,26.23 0 top
JP40  45.91,104.33 0 top
L1  10.67,104.97 90 top
L4  50.35,24.95 0 top
OK4  16.7,12.26 270 top
Q2  37.66,33.21 180 top
R1  22.73,19.24 270 top
R2  17.34,92.27 270 top
R3  15.11,92.27 270 top
R4  24,92.27 270 top
R5  21.78,92.27 270 top
R6  21.78,31.62 0 top
R7  46.23,22.1 90 top
R8  16.78,6.29 0 top
R9  41.47,12.57 180 top
R10  53.53,39.56 180 top
R11  53.53,37.34 180 top
R12  26.86,70.67 180 top
R13  47.81,86.55 0 top
R14  19.56,92.27 270 top
R15  8.45,22.41 0 top
R16  22.1,5.27 0 top
R76  12.89,32.26 180 top
R77  7.17,31.3 270 top
R79  52.58,10.67 180 top
R80  52.58,15.11 0 top
R81  52.58,18.29 180 top
R82  52.58,22.73 0 top
R124  41.47,10.35 180 top
SJ1  58.29,16.38 90 bottom
SJ2  22.1,2.73 0 top
SV1  48.45,43.37 180 top
SV2  48.45,73.85 180 top
U2  39.56,24.32 0 top
U$15  65.91,17.97 90 top
UEXT  25.91,58.61 90 top
X1  11.62,61.15 90 top
X2  -1.71,95.44 270 top
X3  -1.71,26.86 270 top
X4  -1.71,13.84 270 top

### Tracks (layer width: path | path; a pad name or v marks a point on that pad's centre or on a via)
!PROBE_ISOLATED  (via drill 0.6)
  Top 0.406: OK4.14 18.61,10.67 19.24,11.3 23.37,11.3 24.32,12.26 24.32,38.92 26.23,40.83 30.04,40.83 30.67,41.47 30.67,44.96 31.62,45.91 31.62,70.67 v30.67,71.63 | v46.86,80.83 v46.86,84.33 46.86,86.55 R13.1 | v35.11,85.6 IC7.15
  Bottom 0.406: v30.67,71.63 40.2,71.63 40.83,72.26 40.83,79.56 42.1,80.83 v46.86,80.83 | v46.86,84.33 46.86,84.96 46.23,85.6 v35.11,85.6
+3V3  (via drill 0.6)
  Top 0.406: 42.1,59.56 42.1,58.93 41.78,58.61 38.61,58.61 38.29,58.29 IC3.13 v38.29,49.09 | 42.1,59.56 IC3.1 | IC2.13 53.53,58.61 | 53.53,58.61 56.7,58.61 57.34,59.24 57.34,59.56 | 57.34,59.56 IC2.1 | C20.1 57.39,59.61 57.34,59.56 | 42.1,59.56 42.15,59.61 C21.1 52.53,59.61 53.53,58.61 | U2.15 43.78,25.27 | 43.78,25.27 43.78,24.73 43.37,24.32 40.51,24.32 | 40.51,24.32 37.34,24.32 | 37.34,24.32 35.75,24.32 35.34,24.73 35.34,25.27 | U2.28 35.34,25.27 | 37.34,24.32 37.28,24.37 U2.25 37.28,29.45 36.07,30.67 34.48,30.67 34.16,30.99 34.16,32.16 C28.2 | 44.01,33.53 C32.2 44.01,33.21 43.69,32.89 42.42,32.89 41.78,32.26 41.78,30.99 41.19,30.39 U2.19 41.19,26.56 40.53,25.91 | 40.53,25.91 U2.20 40.51,27.97 40.51,30.67 41.15,31.3 41.15,33.31 C31.2 | 40.53,25.91 40.53,24.34 40.51,24.32 | C30.2 32.68,25.27 35.34,25.27 | 43.78,25.27 44,25.06 C29.2 46.65,24.95 L4.1 | v43.05,15.11 42.42,15.11 42.42,12.68 R9.1 R124.1 | v40.51,23.37 40.51,24.32 | C25.1 33.48,92.63 34.16,91.95 | R16.2 v24.95,5.27 | v30.67,5.91 30.67,6.86 31.62,7.81
  Top 0.61: SV1.17 31.94,44.64 | IC7.20 34.16,91.95 33.53,91.31 33.53,84.01 34.16,83.38 34.16,78.93 33.53,78.3 20.83,78.3 19.24,76.71 19.24,69.41 18.29,68.45 18.29,41.47 19.24,40.51 v19.56,40.51 | IC4.13 31.62,7.81 30.99,8.45 30.99,10.67 30.04,11.62 | 30.04,11.62 IC4.1 | 30.04,11.62 29.99,11.67 C12.1 28.13,13.53 27.18,14.48 27.18,25.27 | v28.77,35.75 28.77,33.84 27.18,32.26 27.18,25.27 | v28.77,35.75 28.77,35.8 28.82,35.75 v28.77,35.75 | C30.2 27.39,25.06 27.18,25.27
  Bottom 0.406: v38.29,49.09 36.07,49.09 31.94,44.96 SV1.17 | v43.05,15.11 43.05,20.83 v40.51,23.37 | v24.95,5.27 30.04,5.27 v30.67,5.91
  Bottom 0.61: 28.77,40.51 31.04,40.51 31.94,41.41 SV1.17 | 28.77,40.51 v28.77,35.75 | v19.56,40.51 28.77,40.51
+5V  (via drill 0.6)
  Top 0.406: 71.31,76.07 71.31,71.94 | C18.1 42.47,53.8 42.1,54.16 IC3.16 | C17.1 57.7,53.8 57.34,54.16 IC2.16 | R13.2 48.66,86.45 48.45,86.23 v48.45,84.33 | SV2.19 26.86,72.9 26.23,72.26 26.23,70.89 R12.2
  Top 0.61: 71.31,71.94 v71.31,51.62 | C17.1 v60.52,51.62 | v45.27,51.62 C18.1 | 24,94.81 21.78,94.81 | 21.78,94.81 19.56,94.81 | 19.56,94.81 17.34,94.81 | 17.34,94.81 15.11,94.81 R3.1 | R2.1 17.34,94.81 | R14.1 19.56,94.81 | R5.1 21.78,94.81 | R4.1 24,94.81 | 24,94.81 v26.54,94.81
  Top 1.016: IC1.2 C5.1 58.88,96.98 58.93,97.03 59.83,97.03 C4.1 C6.1 62.47,97.03 65.59,97.03 | JP21.1 JP21.2 61.15,101.79 61.47,101.47 64.96,101.47 65.59,100.84 65.59,97.03 | 65.59,97.03 69.72,97.03 71.31,95.44 71.31,91 | 71.31,91 71.31,76.07 | v70.04,90.68 70.99,90.68 71.31,91
  Bottom 0.406: v48.45,84.33 48.45,82.11
  Bottom 0.61: v71.31,51.62 v60.52,51.62 v45.27,51.62 | v26.54,94.81 28.45,94.81 29.72,93.53 29.72,88.45 30.67,87.5 30.67,85.92 29.72,84.96 29.72,82.11
  Bottom 1.016: v70.04,90.68 70.04,83.69 68.45,82.11 48.45,82.11 29.72,82.11 26.86,79.25 SV2.19
+10V
  Top 0.406: 68.77,76.07 68.77,71.94 | 68.77,45.59 68.77,41.15
  Top 0.61: 68.77,41.15 72.9,37.02 72.9,10.35 70.99,8.45 69.09,8.45 66.55,5.91 38.61,5.91 37.02,7.17 37.02,11.62 | C13.1 37.02,13.53 37.02,11.62 | IC4.16 37.02,11.62 | 68.77,71.94 68.77,45.59
  Top 1.016: IC5.2 C9.1 C10.1 C11.1 39.56,96.98 | 39.56,96.98 C1.1 C2.1 C3.1 IC1.1 | 39.56,96.98 39.56,103.69 38.92,104.33 JP2.2 JP2.1 | 39.56,96.98 39.56,95.12 40.2,94.49 66.55,94.49 68.77,92.27 68.77,76.07
+10V1  (via drill 0.6)
  Top 0.406: C22.1 14.21,20.24 v14.16,20.19 | v14.16,6.22 15.68,6.22 R8.1
  Top 1.016: C22.1 C19.1 C23.1 22.68,20.24 R1.1 22.73,21.14 21.78,22.1 IC6.4 21.78,26.23 23.05,27.5 23.05,31.3 R6.2
  Bottom 0.406: v14.16,20.19 v14.16,6.22
+12V  (via drill 0.6)
  Top 0.406: R15.2 9.4,22.41 v9.4,24
  Top 1.016: IC5.1 C14.1 C15.1 C16.1 16.65,97.03 14.16,97.03 14.16,104.33 | 14.16,104.33 JP20.1 JP20.2 | L1.2 13.48,106.92 14.16,106.23 14.16,104.33
  Bottom 0.406: v9.4,24 10.98,24 11.94,24.95 11.94,26.86 12.26,27.18
  Bottom 1.016: IC6.2 16.7,25.91 15.43,27.18 12.26,27.18 11.94,27.18 10.98,28.13 10.98,33.53 10.35,34.16 5.91,34.16 5.27,34.8 5.27,86.87 8.13,89.72 8.13,101.47 10.98,104.33 JP20.1
ABORT  (via drill 0.6)
  Top 0.406: X1.10 15.77,69.43 17.02,70.67 17.02,79.25 | 17.02,79.25 17.02,86.87 17.65,87.5 21.14,87.5 21.78,88.14 R5.2 | IC7.11 v35.43,80.52 | v17.97,79.25 17.02,79.25 | v21.78,79.56 22.1,79.25 31.62,79.25 v32.89,80.52
  Bottom 0.406: v17.97,79.25 21.46,79.25 v21.78,79.56 | v32.89,80.52 v35.43,80.52
CT1
  Top 0.406: U$15.2 58.61,21.14 57.02,19.56 51.73,19.56 | L4.2 51.73,24.43 R82.1 51.73,20.19 | 51.73,20.19 51.73,19.56 | 51.73,19.56 R81.2 | C34.2 51.73,20.19
DIRECTION_A  (via drill 0.6)
  Top 0.406: 12.89,66.87 X1.9 | v35.75,64.33 IC3.6
  Bottom 0.406: 35.75,64.54 v35.75,64.33 35.75,65.91 35.11,66.55 29.72,66.55 27.81,68.45 23.05,68.45 19.67,65.07 15.95,65.07 14.48,66.55 13,66.55 X1.9
DIRECTION_X  (via drill 0.6)
  Top 0.406: v19.56,50.35 v19.56,67.82 | v53.53,64.01 IC2.4
  Bottom 0.406: X1.3 19.18,50.1 v19.56,50.35 | v53.53,64.01 53.53,68.45 51.94,70.04 21.14,70.04 19.56,68.45 v19.56,67.82
DIRECTION_Y  (via drill 0.6)
  Top 0.406: v49.72,53.21 IC2.10
  Bottom 0.406: X1.5 13.64,55.64 16.7,52.58 21.46,52.58 23.37,50.67 23.37,49.4 23.68,49.09 32.26,49.09 33.84,50.67 33.84,51.62 33.21,52.26 33.21,53.53 33.53,53.85 35.11,53.85 35.75,53.21 v49.72,53.21
DIRECTION_Z  (via drill 0.6)
  Top 0.406: v56.07,52.9 IC2.15
  Bottom 0.406: v56.07,52.9 56.07,57.34 51.62,61.78 35.43,61.78 33.84,63.37 33.84,64.64 33.21,65.28 29.08,65.28 27.18,67.18 23.68,67.18 19.56,63.05 15.11,63.05 13.21,61.15 X1.7
ETH_RST
  Top 0.406: U2.10 41.19,14.52 40.2,13.53 40.2,12.68 R9.2
EXTERNAL_POWER
  Top 0.406: OK4.12 16.06,8.13 15.75,7.81 12.57,7.81 12.26,7.49 12.26,4.63 12.57,4.32 18.92,4.32 | 18.92,4.32 19.88,5.27 R16.1 | SJ2.1 20.51,2.73 18.92,4.32
GND  (via drill 0.6, 3.2 pad 5.1)  (1 unrouted)
  Top 0.406: IC2.8 48.45,64.33 48.13,64.64 | IC3.8 33.21,64.96 | IC7.10 24.32,80.52 | 39.23,25.9 v38.92,25.59 | U2.18 41.84,25.86 v42.1,25.59
  other vias: 58.61,57.34 31.94,101.47 69.09,95.12 31.94,86.87 21.78,84.33 70.04,58.61 4,109 74,109 74,4 3.99,3.99 36.07,78.61 39.56,30.04 10.35,17.97 7.17,13.84 12.89,90.68 50.35,13.21 52.58,28.13 48.77,27.81 47.5,19.24 40.51,8.45 28.45,23.68 58.61,3.37 44.32,2.73 60.2,29.08 69.72,17.97 64.96,7.81 32.26,35.75 29.4,27.18 28.45,15.43 70.04,79.56 22.73,81.47 22.41,13.84
  pour Bottom: -2.35,115.76 28.13,115.76 28.13,123.38 49.72,123.38 49.72,115.76 80.2,115.76 80.2,-2.35 -2.35,-2.35
  pour Top: -2.35,115.76 1.46,115.76 1.46,123.38 19.24,123.38 19.24,115.76 80.2,115.76 80.2,-2.35 -2.35,-2.35
LIMIT_X  (via drill 0.6)
  Top 0.406: X1.11 15.68,72.2 16.38,72.9 16.38,87.19 17.34,88.14 18.92,88.14 19.56,88.77 v19.56,89.41 R14.2 | IC7.2 25.91,90.68 25.27,90.04 v25.27,89.41
  Bottom 0.406: v25.27,89.41 v19.56,89.41
LIMIT_Y  (via drill 0.6)
  Top 0.406: X1.13 14.21,77.71 15.11,78.61 v15.11,89.41 R3.2 | IC7.6 v18.92,85.6
  Bottom 0.406: v18.92,85.6 v15.11,89.41
LIMIT_Z  (via drill 0.6)
  Top 0.406: X1.12 14.62,74.94 15.75,76.07 15.75,88.14 v17.18,89.25 17.34,89.72 R2.2 | IC7.4 v25.27,88.14
  Bottom 0.406: v25.27,88.14 18.29,88.14 v17.18,89.25
MISO  (via drill 0.6)
  Top 0.406: UEXT.7 25.91,59.88 24,59.88 23.37,59.24 23.37,47.18 25.59,44.96 25.59,42.1 23.37,39.88 23.37,38.29 22.73,37.66 v22.73,34.16 | U2.6 38.59,19.36 38.15,18.92 v36.07,18.92
  Bottom 0.406: v22.73,34.16 22.73,29.4 23.37,28.77 25.2,28.77 25.91,28.05 25.91,19.24 26.23,18.92 v36.07,18.92
MOSI  (via drill 0.6)
  Top 0.406: UEXT.8 23.05,61.15 22.73,60.83 22.73,38.61 21.46,37.34 v21.46,34.16 | U2.7 39.23,18.91 37.97,17.65 v36.07,17.65
  Bottom 0.406: v21.46,34.16 21.46,28.77 22.1,28.13 24.82,28.13 25.27,27.68 25.27,18.61 25.91,17.97 35.75,17.97 v36.07,17.65
N$1
  Top 1.016: X2.1 8.76,97.98 10.35,99.57 10.35,103.02 L1.1
N$2
  Top 0.406: U2.24 37.94,30.39 37.34,30.99 37.34,32.26 | 37.34,32.26 37.34,35.33 C24.1 | Q2.3 37.14,32.06 37.34,32.26
N$3
  Top 0.406: R77.1 9.25,32.16 | C7.1 11.99,32.3
  Top 0.61: 9.25,32.16 C7.1 | 11.99,32.3 R76.2
N$4
  Top 0.406: U2.26 36.63,29.15 35.75,30.04 30.67,30.04 30.35,30.35 30.35,37.97 30.67,38.29 33.53,38.29 34.48,39.24 49.4,39.24 51.31,37.34 R11.2
N$5
  Top 0.406: R1.2 22.73,17.97 21.14,16.38 OK4.1
N$6  (via drill 0.6)
  Top 0.406: v10.35,16.38 10.35,13.84 11.3,12.89 19.24,12.89 19.88,13.53 OK4.2 | v7.17,16.38 X4.1
  Bottom 0.406: v10.35,16.38 v7.17,16.38
N$7
  Top 1.016: IC6.3 19.24,26.54 18.76,27.02 | 18.76,27.02 18.61,27.18 12.26,27.18 11.62,26.54 11.62,19.56 | 11.62,19.56 14.16,18.29 14.11,18.29 C22.2 C19.2 C23.2 | 11.62,19.56 9.71,19.56 8.76,18.61 8.76,12.01 8.05,11.3 X4.2 | R6.1 20.83,29.09 18.76,27.02
N$8
  Bottom 0.406: SJ1.2 60.64,17.14 U$15.5
N$10
  Top 0.406: U2.27 35.98,28.85 35.43,29.4 30.35,29.4 29.72,30.04 29.72,38.29 30.35,38.92 33.21,38.92 34.16,39.88 52.36,39.88 R10.2
N$11
  Top 0.254: 17.97,7.49 17.97,11.3 | 20.51,12.57 20.51,16.7
  Top 0.406: R8.2 17.63,7.15 17.97,7.49 | 17.97,11.3 18.61,11.94 19.88,11.94 20.51,12.57 | 20.51,16.7 20.19,17.02 18.92,17.02 18.61,16.7 OK4.3
N$12  (via drill 0.6)
  Top 0.406: v12.57,11.62 v15.75,11.62 | v17.34,13.84 OK4.4
  Bottom 0.406: JP3.1 4.95,13.84 7.17,11.62 v12.57,11.62 | v15.75,11.62 16.38,11.62 17.34,12.57 v17.34,13.84
N$13  (via drill 0.6)
  Top 0.406: OK4.5 16.06,16.38 15.75,16.7 12.57,16.7 v12.26,17.02 | v7.17,20.83 7.17,22 R15.1
  Bottom 0.406: v12.26,17.02 12.26,18.92 10.35,20.83 v7.17,20.83
N$45
  Top 0.406: C8.1 R77.2 | X3.1 4.63,29.4 5.91,28.13 7.13,28.13 8.76,28.13 9.08,27.81 9.08,26.86 JP39.1
  Top 0.61: 7.13,28.13 C8.1
N$47  (via drill 0.6)
  Top 0.406: IC4.2 26.54,10.35 26.23,10.67 26.23,35.11 v26.86,35.75 | R76.1 15.43,32.26 16.06,32.89 16.06,35.43 16.38,35.75 v17.34,35.75
  Bottom 0.406: v26.86,35.75 v17.34,35.75
N$53
  Top 0.406: U2.23 38.59,30.69 37.97,31.3 37.97,34.16 | 37.97,34.16 37.97,36.28 C26.1 | Q2.1 38.17,34.36 37.97,34.16
N$54
  Top 0.406: U2.14 43.78,19.46 44.01,19.24 45.91,19.24 46.23,19.56 R7.1
N$55
  Top 0.406: U2.1 35.34,21.56 34.8,22.1 C27.2 33.74,22.1
N$57  (via drill 0.6)
  Top 0.406: R80.1 51.73,14.38 51.94,14.16 53.21,14.16 53.53,13.84 53.53,12.99 C33.1 | R79.2 51.73,11.41 51.94,11.62 53.21,11.62 53.53,11.94 53.53,12.79 C33.1 | C33.1 54.48,12.89 55.44,13.84 57.34,13.84 57.66,13.53 v58.29,13.53
  Bottom 0.406: v58.29,13.53 SJ1.1
N$74  (via drill 0.6)
  Top 0.406: v54.16,8.13 55.44,6.86 60.52,6.86 65.91,12.26 65.91,23.37 64.64,24.64 64.64,36.7 61.78,39.56 R10.1
  Bottom 0.406: U$15.11 56,17.9 54.16,15.75 v54.16,8.13
N$76  (via drill 0.6)
  Top 0.406: v56.07,8.45 61.15,8.45 65.28,12.57 65.28,23.05 64.01,24.32 64.01,35.99 62.66,37.34 R11.1
  Bottom 0.406: v56.07,8.45 56.07,12.44 U$15.9
PROBE
  Top 0.406: X1.15 13.8,48.73 14.48,49.4 14.48,67.18 17.65,70.36 17.65,77.34 19.24,78.93 19.24,80.2 17.65,81.79 17.65,83.06 | 17.65,83.06 17.65,86.23 18.29,86.87 23.37,86.87 24,87.5 R4.2 | IC7.8 17.65,83.06
PROBE_ISOLATED
  Top 0.406: 33.37,75.91 33.21,75.75 33.21,71.63 32.26,70.67 32.26,47.81 33.21,46.86 33.21,40.83 32.58,40.2 26.86,40.2 24.95,38.29 24.95,8.45 24.32,7.81 21.78,7.81 21.14,8.45 OK4.16 | 33.37,75.91 34.8,77.34 39.56,77.34 39.88,77.66 39.88,82.74 39.56,83.06 IC7.13 | 33.37,75.91 32.58,76.71 28.77,76.71 28.13,76.07 28.13,70.67 R12.1
RB0
  Top 0.406: SV2.16 34.48,75.12 35.75,76.39 39.56,76.39 40.83,77.66 40.83,85.92 39.88,86.87 IC7.16
RC13  (via drill 0.6)
  Top 0.406: IC7.7 v24.64,84.33
  Bottom 0.406: SV2.2 70.04,77.03 70.99,77.98 74.17,77.98 74.8,78.61 74.8,91.63 74.17,92.27 66.23,92.27 65.59,92.9 65.59,95.44 64.96,96.08 25.91,96.08 25.59,95.76 25.59,93.85 26.23,93.22 26.23,85.28 25.27,84.33 v24.64,84.33
RC14  (via drill 0.6)
  Top 0.406: SV2.1 72.58,80.52 v72.9,80.83 | v50.04,80.52 v50.04,84.33 | v30.35,94.81 29.08,94.81 v27.5,93.22 | v29.4,86.87 IC7.5
  Bottom 0.406: v72.9,80.83 50.35,80.83 v50.04,80.52 | v50.04,84.33 47.81,86.55 38.61,86.55 v30.35,94.81 | v27.5,93.22 27.5,88.14 28.77,86.87 v29.4,86.87
RD1  (via drill 0.6)
  Top 0.406: IC4.3 26.54,9.08 25.59,10.03 25.59,37.97 27.18,39.56 32.89,39.56 33.84,40.51 35.11,40.51 35.75,41.15 35.75,45.27 v35.11,45.91 | SV1.6 59.88,45.91 58.61,47.18 v37.66,47.18 35.75,49.09 IC3.11
  Bottom 0.406: v35.11,45.91 36.38,45.91 v37.66,47.18
RD4  (via drill 0.6)
  Top 0.406: IC3.9 33.21,49.72 37.02,45.91 v56.07,45.91
  Bottom 0.406: v56.07,45.91 66.55,45.91 67.5,44.96 SV1.3
RD6  (via drill 0.6)
  Top 0.406: SJ2.2 v24.95,2.73
  Bottom 0.406: v24.95,2.73 41.47,2.73 43.05,4.32 68.77,4.32 74.48,10.03 74.48,38.92 72.58,40.83 SV1.1
RD7  (via drill 0.6)
  Top 0.406: v30.67,80.52 30.67,81.15 30.04,81.79 IC7.9
  Bottom 0.406: SV2.15 37.02,76.07 36.7,76.39 30.99,76.39 30.67,76.71 v30.67,80.52
RD8  (via drill 0.6)
  Top 0.406: IC7.12 38.61,81.79 38.92,81.47 38.92,79.25 38.61,78.93 v37.97,78.93
  Bottom 0.406: v37.97,78.93 38.61,78.93 39.56,77.98 SV2.14
RD11
  Top 0.406: IC7.18 40.51,89.41 42.1,87.82 SV2.13
RE0  (via drill 0.6)
  Top 0.406: v65.59,64.64 55.75,64.64 54.8,63.69 IC2.3
  Bottom 0.406: SV2.3 67.5,65.91 66.23,64.64 v65.59,64.64
RE1
  Top 0.406: SV2.4 64.96,67.13 64.06,66.23 53.53,66.23 52.26,64.96 IC2.5
RE2
  Top 0.406: SV2.5 62.42,68.08 61.52,67.18 51.31,67.18 49.72,65.59 IC2.7
RE3  (via drill 0.6)
  Top 0.406: IC2.9 48.45,49.4 49.4,48.45 62.42,48.45 64.01,50.04 v64.01,63.05
  Bottom 0.406: SV2.6 59.88,69.41 64.01,65.28 v64.01,63.05
RE4  (via drill 0.6)
  Top 0.406: IC2.11 50.99,50.04 51.62,49.4 61.78,49.4 63.05,50.67 v63.05,61.15
  Bottom 0.406: v63.05,61.15 63.05,64.96 57.34,70.67 SV2.7
RE5  (via drill 0.6)
  Top 0.406: IC2.14 54.8,50.67 55.44,50.04 61.47,50.04 62.1,50.67 v62.1,63.05
  Bottom 0.406: v62.1,63.05 62.1,64.01 54.8,71.31 SV2.8
RE6
  Top 0.406: SV2.9 52.26,70.57 50.46,68.77 40.51,68.77 39.56,67.82 IC3.3
RE7
  Top 0.406: SV2.10 49.72,70.99 48.77,70.04 38.29,70.04 37.02,68.77 IC3.5
RF1
  Top 0.406: SV2.11 47.18,71.63 46.86,71.31 35.11,71.31 34.48,70.67 IC3.7
RG9  (via drill 0.6)
  Top 0.406: SV2.12 v44.64,84.33 | v39.56,84.33 IC7.14
  Bottom 0.406: v44.64,84.33 v39.56,84.33
SCK/LED1  (via drill 0.6)
  Top 0.406: UEXT.9 27.18,64.33 26.54,64.96 22.41,64.96 21.46,64.01 21.46,39.24 18.92,36.7 v18.92,34.16 | U2.8 39.88,18.3 37.02,15.43 v36.07,15.43
  Bottom 0.406: v18.92,34.16 18.92,27.5 19.56,26.86 23.37,26.86 24,26.23 24,17.84 25.15,16.7 33.53,16.7 34.8,15.43 v36.07,15.43
SPINDLE_ENABLE  (via drill 0.6)
  Top 0.406: v34.48,52.9 IC3.10
  Bottom 0.406: X1.17 13.77,54.24 16.06,51.94 20.83,51.94 22.41,50.35 22.41,48.77 22.73,48.45 32.58,48.45 34.48,50.35 v34.48,52.9
SPINDLE_PWM  (via drill 0.6)
  Top 0.406: v37.02,51.94 IC3.12
  Bottom 0.406: X1.1 18.87,44.59 20.51,46.23 31.3,46.23 v37.02,51.94
STEP_A  (via drill 0.6)
  Top 0.406: v38.29,64.33 IC3.4
  Bottom 0.406: v38.29,64.33 36.38,62.42 35.75,62.42 34.48,63.69 34.48,64.96 33.53,65.91 29.4,65.91 27.5,67.82 23.37,67.82 19.47,63.92 X1.8
STEP_X  (via drill 0.6)
  Top 0.406: v20.51,48.45 v20.51,71.31 | v60.2,62.74 60.2,63.05 59.56,63.69 56.39,63.69 56.07,63.37 IC2.2
  Bottom 0.406: X1.2 19.42,47.36 v20.51,48.45 | v20.51,71.31 21.14,70.67 52.26,70.67 v60.2,62.74
STEP_Y  (via drill 0.6)
  Top 0.406: v29.72,47.5 30.04,47.5 30.99,48.45 30.99,67.5 30.04,68.45 v30.04,68.77 | v50.99,64.01 IC2.6
  Bottom 0.406: v30.04,68.77 30.04,68.45 30.35,68.14 46.86,68.14 v50.99,64.01 | v29.72,47.5 22.41,47.5 21.78,48.13 21.78,50.04 20.51,51.31 15.75,51.31 14.16,52.9 12.91,52.9 X1.4
STEP_Z  (via drill 0.6)
  Top 0.406: v52.26,53.21 IC2.12
  Bottom 0.406: v52.26,53.21 50.99,54.48 49.09,54.48 48.45,53.85 36.07,53.85 35.43,54.48 33.21,54.48 32.58,53.85 32.58,50.99 31.3,49.72 24.32,49.72 24,50.04 24,50.99 21.78,53.21 17.02,53.21 14.79,55.44 14.79,57.34 13.75,58.38 X1.6
STEPPER_ENABLE  (via drill 0.6)
  Top 0.406: IC3.2 40.83,64.64 v41.15,64.96 | v17.02,66.55 v17.02,45.91
  Bottom 0.406: v41.15,64.96 38.92,67.18 30.04,67.18 27.81,69.41 23.05,69.41 20.19,66.55 v17.02,66.55 | v17.02,45.91 10.4,45.91 X1.14
TPIN+
  Top 0.406: U$15.4 59.24,18.61 57.34,16.7 55.44,16.7 55.12,16.38 53.53,16.38 | U2.13 43.13,18.84 44.96,17.02 44.96,12.57 45.27,12.26 47.18,12.26 47.5,12.57 47.5,15.75 48.13,16.38 53.53,16.38 | R80.2 53.43,16.28 53.53,16.38
TPIN-
  Top 0.406: U$15.6 62.1,14.79 62.1,12.26 60.52,10.67 R79.1 53.53,10.57 53.53,9.71 52.9,9.08 44.64,9.08 44.01,9.71 44.01,16.7 42.48,18.22 U2.12
TPOUT+
  Top 0.406: U$15.1 58.61,22.41 58.29,22.1 54.48,22.1 | 54.48,22.1 53.85,22.1 53.43,22.52 R82.2 | U2.17 42.48,29.79 43.05,30.35 45.27,30.35 arc90 46.04,31.11 46.04,32.07 arc-90 46.8,32.84 50.63,32.84 arc-90 51.39,32.07 51.39,31.43 arc90 52.15,30.67 53.21,30.67 54.48,29.4 54.48,22.1
TPOUT-
  Top 0.254: 50.35,29.08 50.35,17.34
  Top 0.406: U$15.3 59.24,19.88 57.66,18.29 R81.1 53.53,18.19 53.53,17.34 53.21,17.02 50.67,17.02 50.35,17.34 | U2.16 43.13,29.16 43.69,29.72 49.72,29.72 50.35,29.08
UEXT_#CS  (via drill 0.6)
  Top 0.406: U2.9 40.53,16.38 | UEXT.10 22.41,63.69 22.1,63.37 22.1,38.92 20.19,37.02 v20.19,34.16 | v39.56,16.38 40.53,16.38 | 40.53,16.38 40.53,15.13 39.24,13.84 39.24,10.67 39.56,10.35 R124.2
  Bottom 0.406: v20.19,34.16 20.19,28.13 20.83,27.5 24.19,27.5 24.64,27.05 24.64,18.23 25.54,17.34 33.84,17.34 34.8,16.38 v39.56,16.38

### Text on the board
Top: TOP
Bottom: CNC_1_0_2 | BOTTOM